# EAGLE board TurtleBoard (EAGLE 7.7.0), part 1 of 2
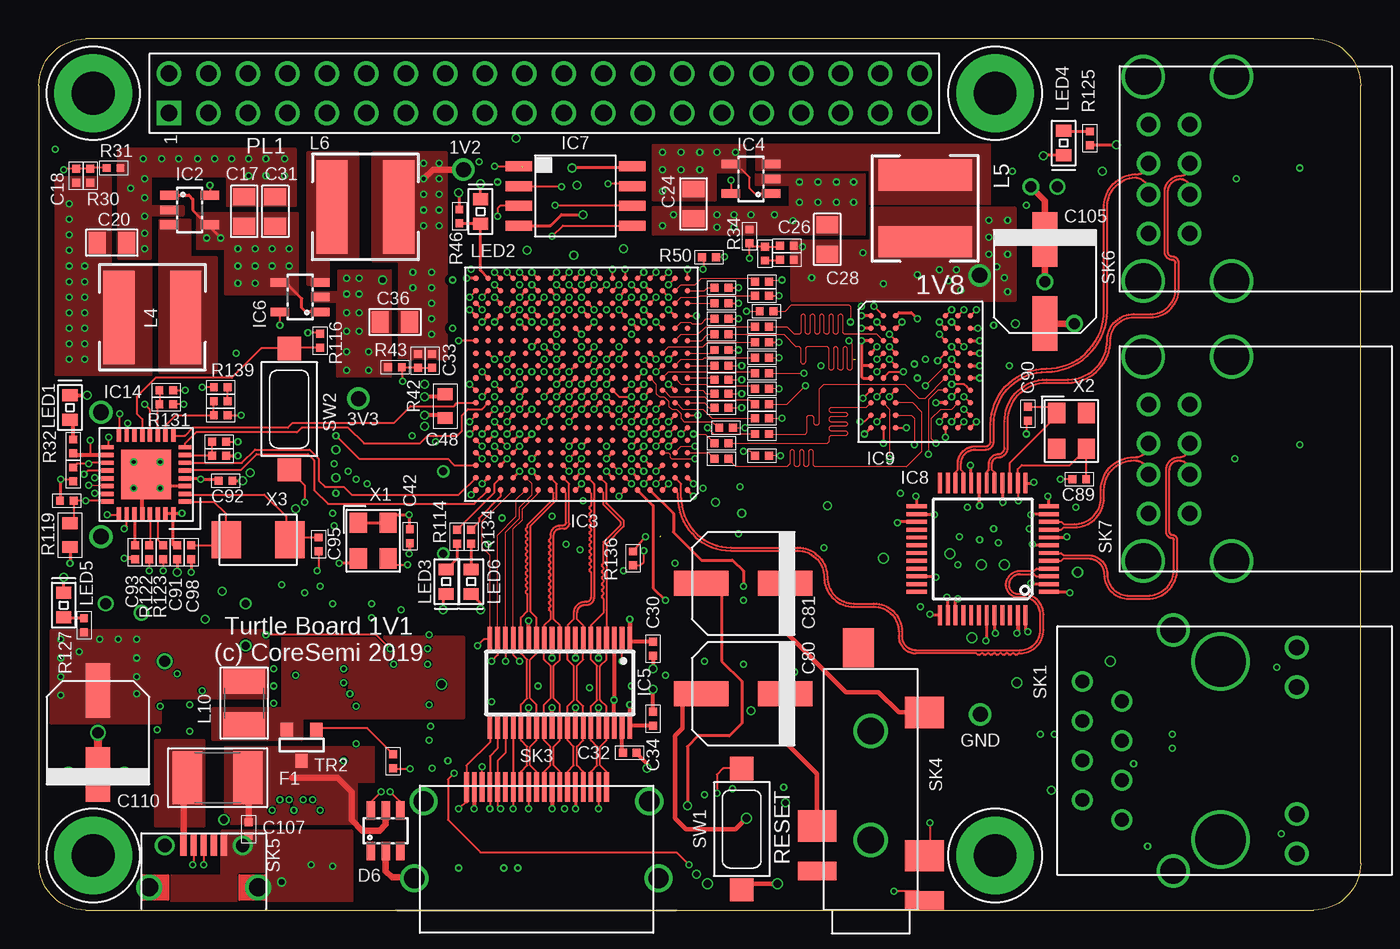
[diagram p7: board, top side]
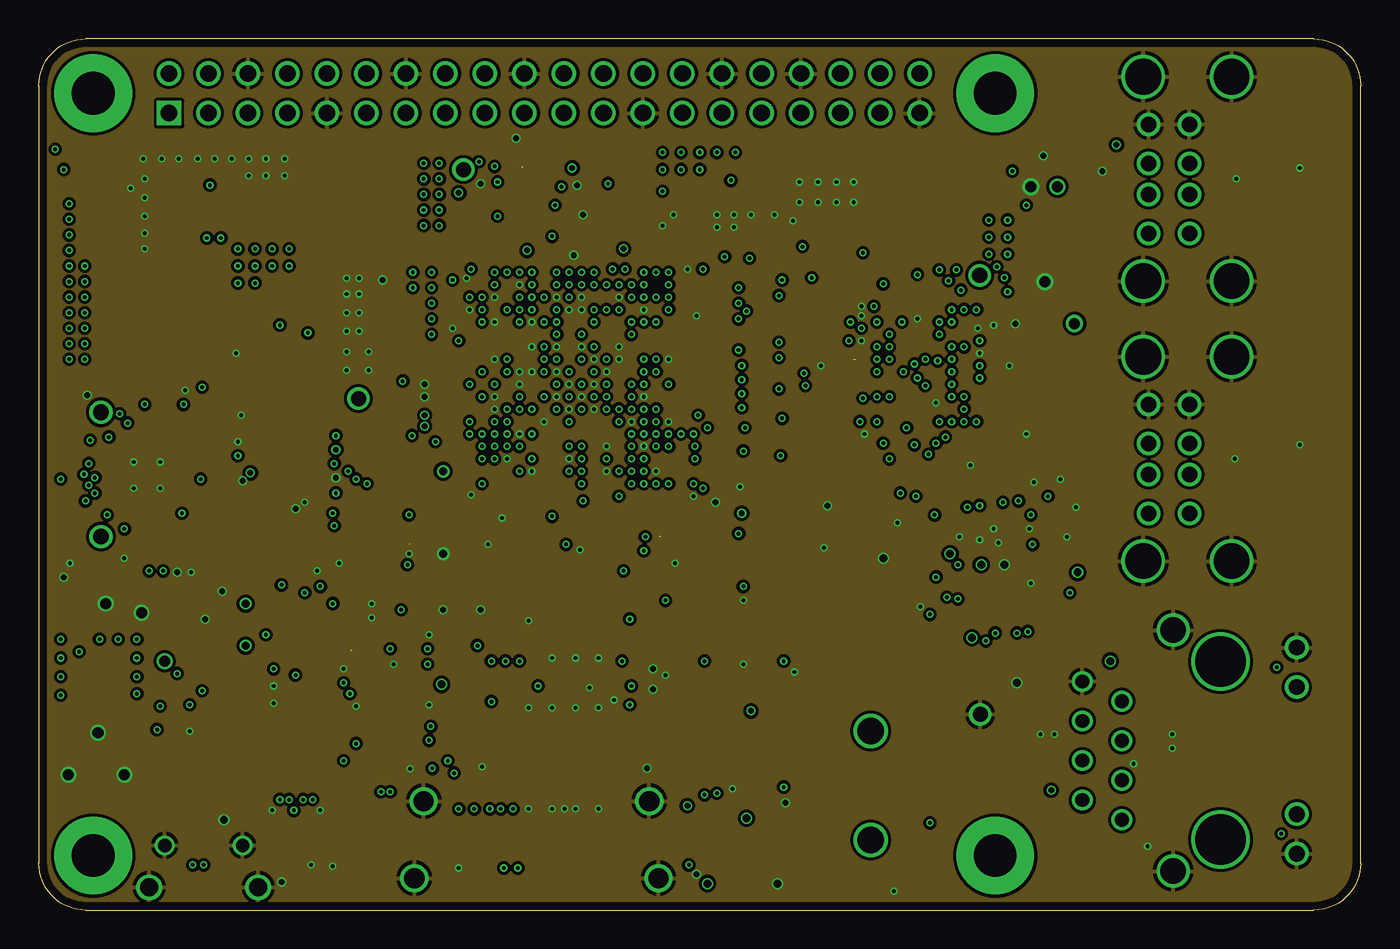
[diagram p8: board, inner layer GND1]
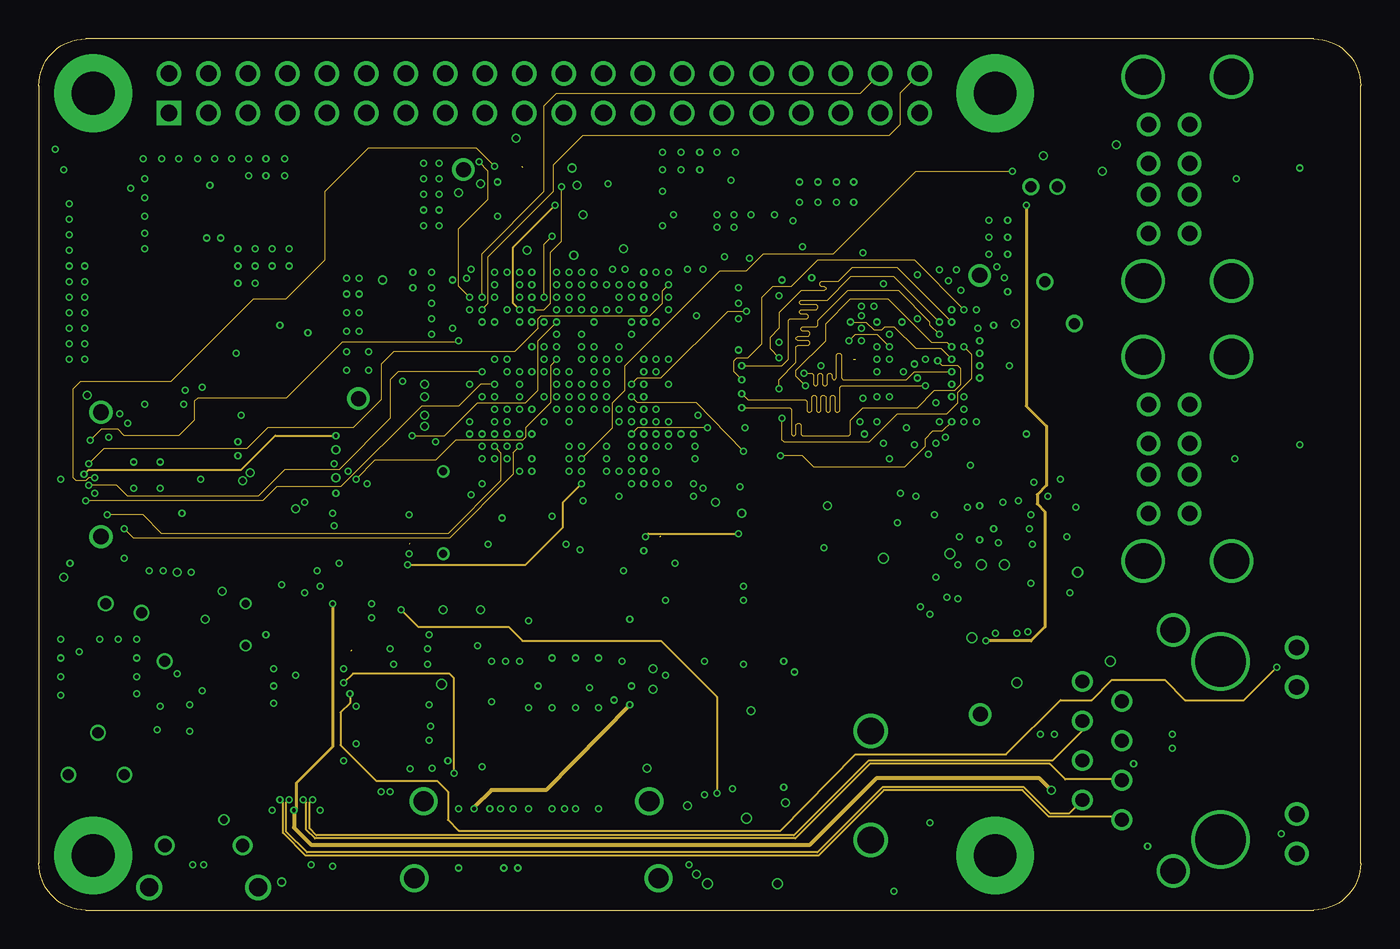
[diagram p9: board, inner layer Sig1]
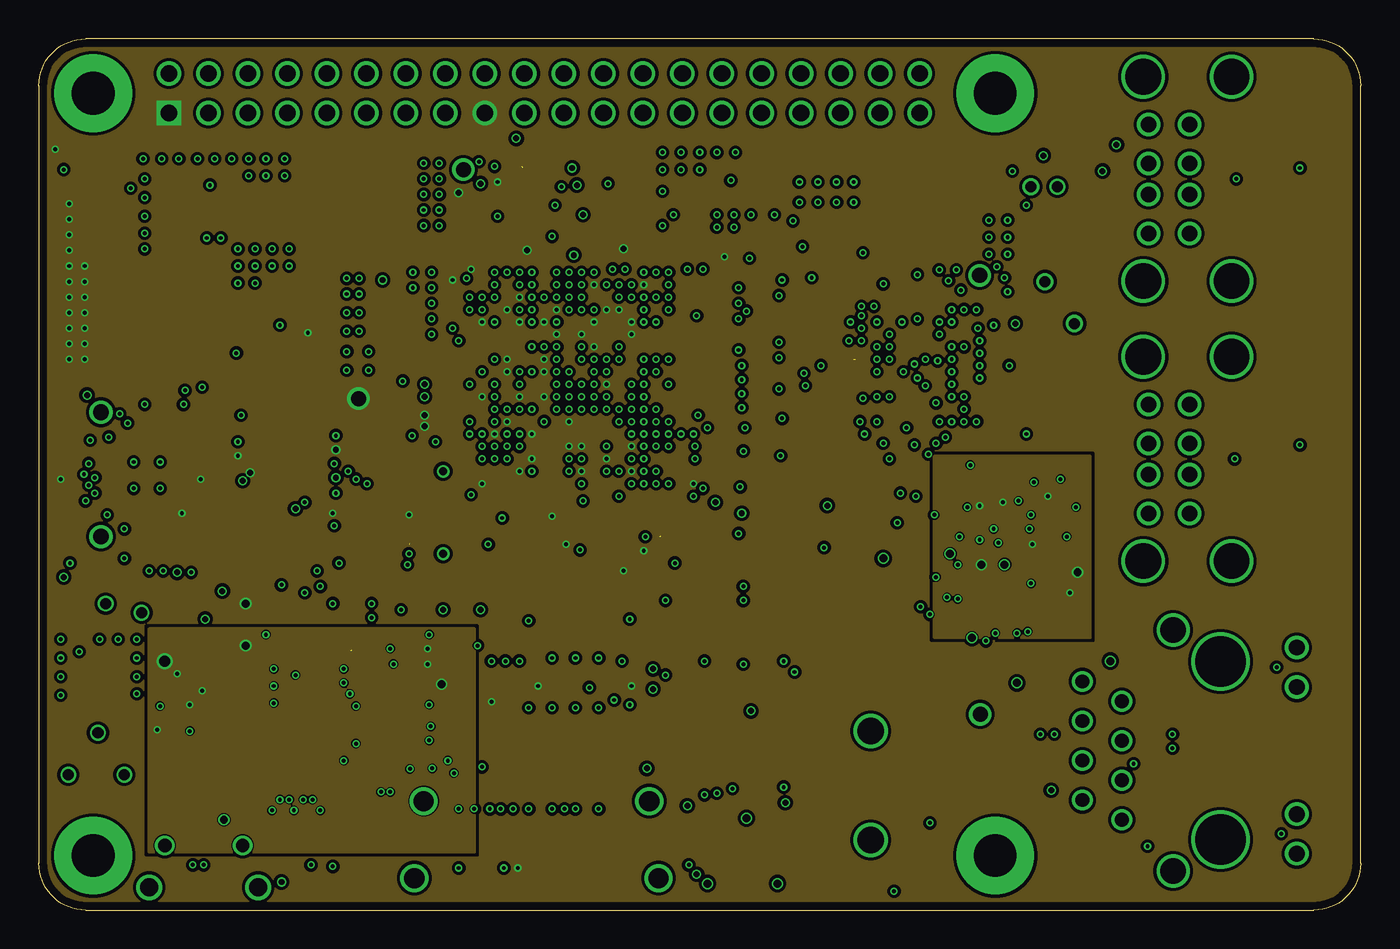
[diagram p10: board, inner layer PWR1]
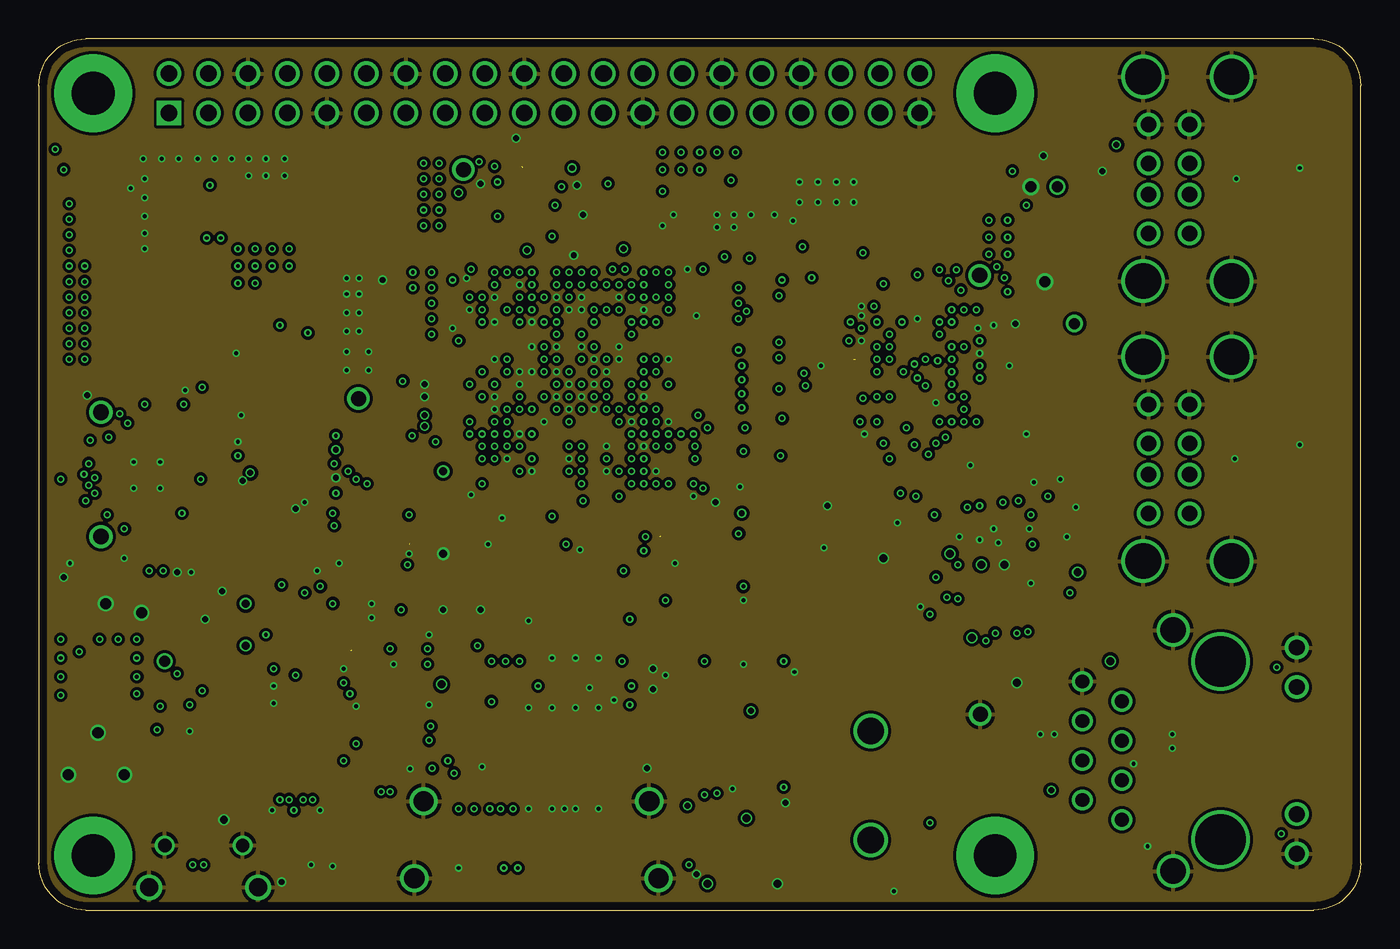
[diagram p11: board, inner layer GND2]
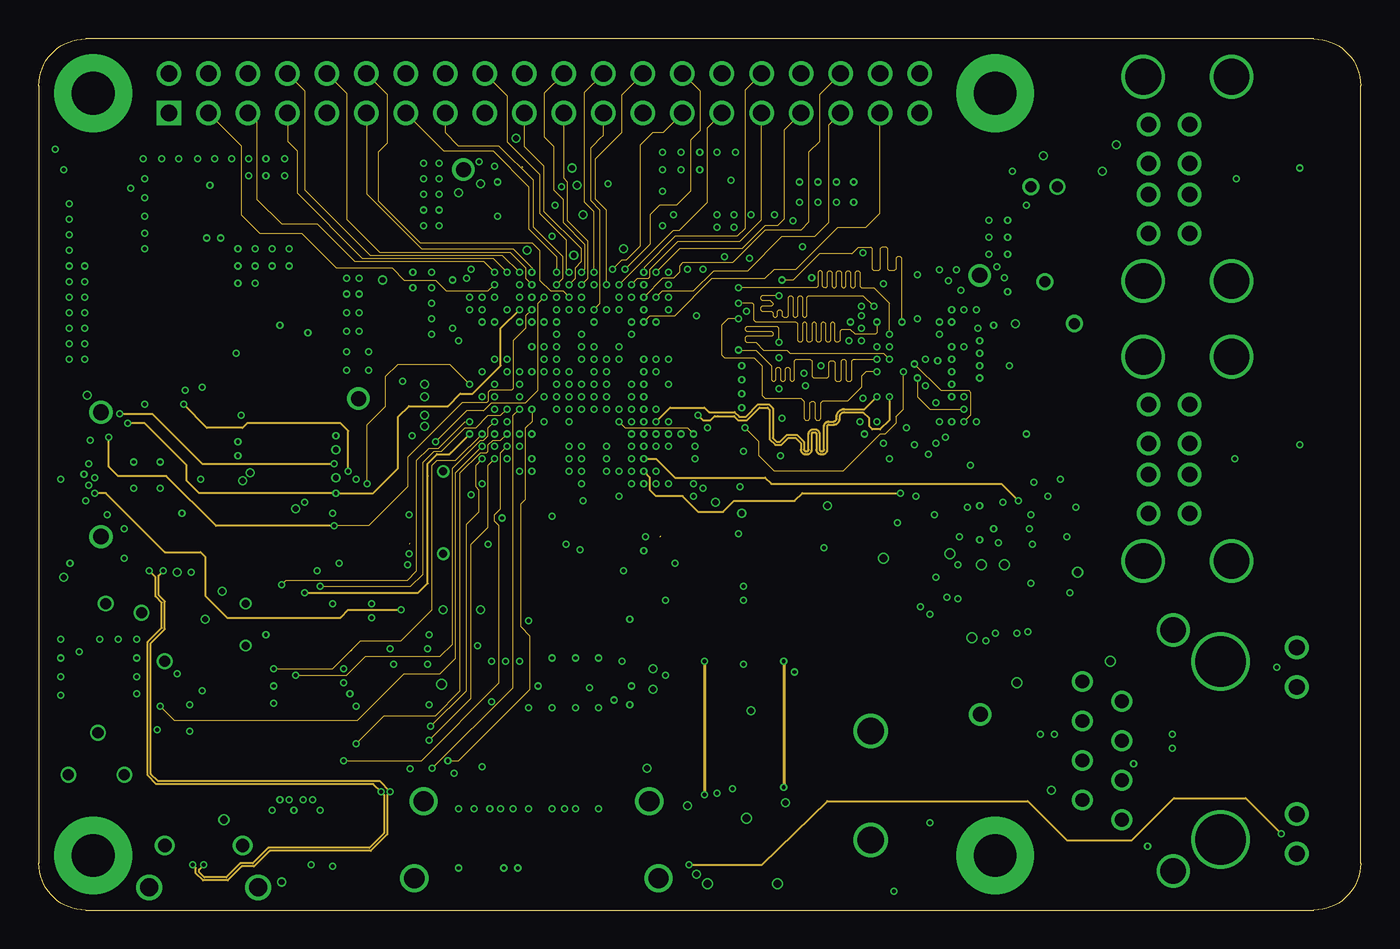
[diagram p12: board, inner layer Sig2]
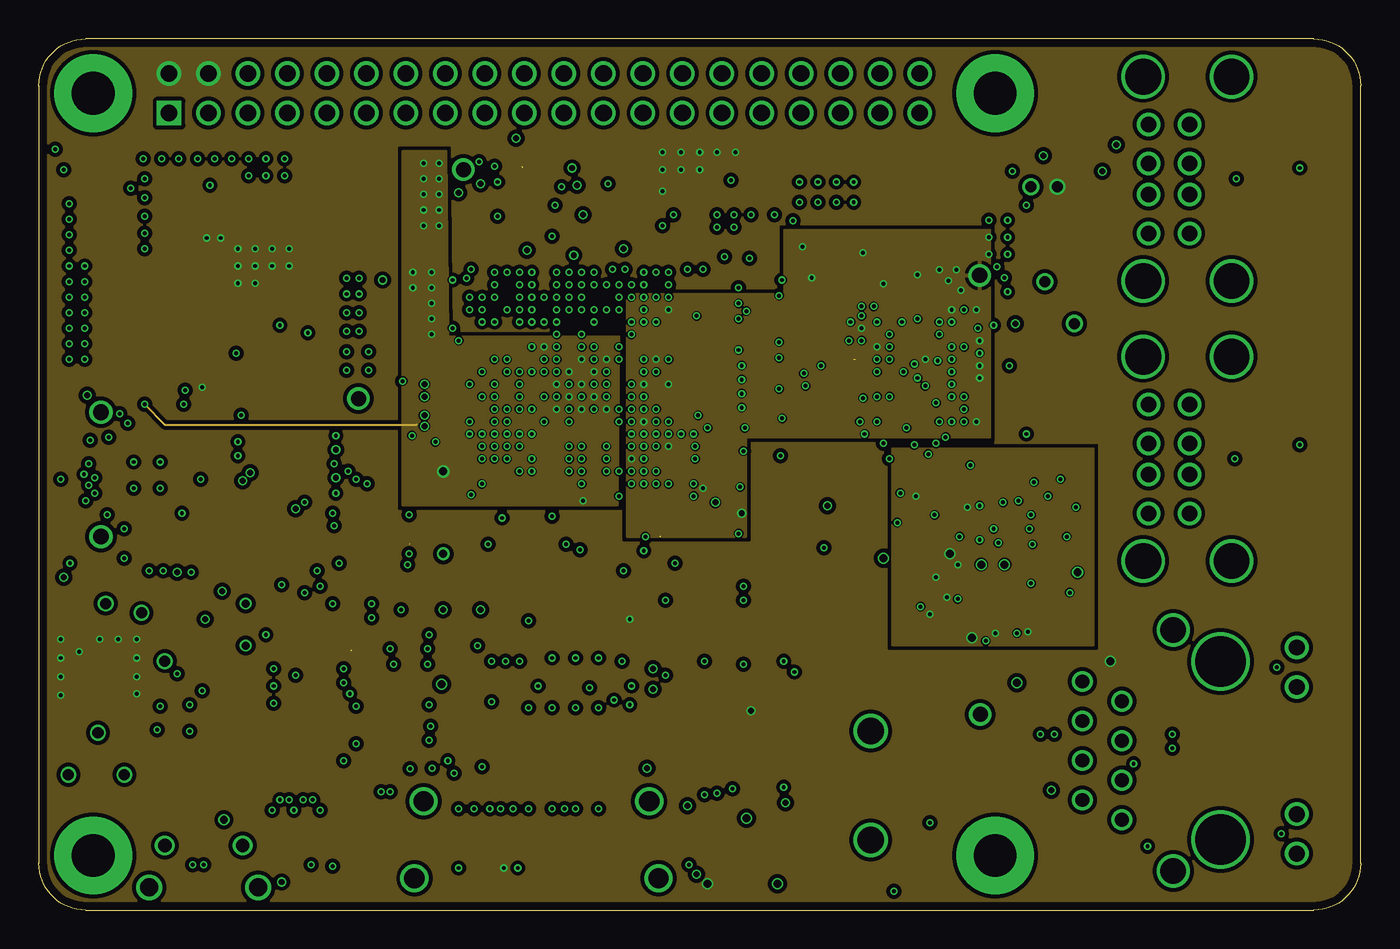
[diagram p13: board, inner layer PWR2]
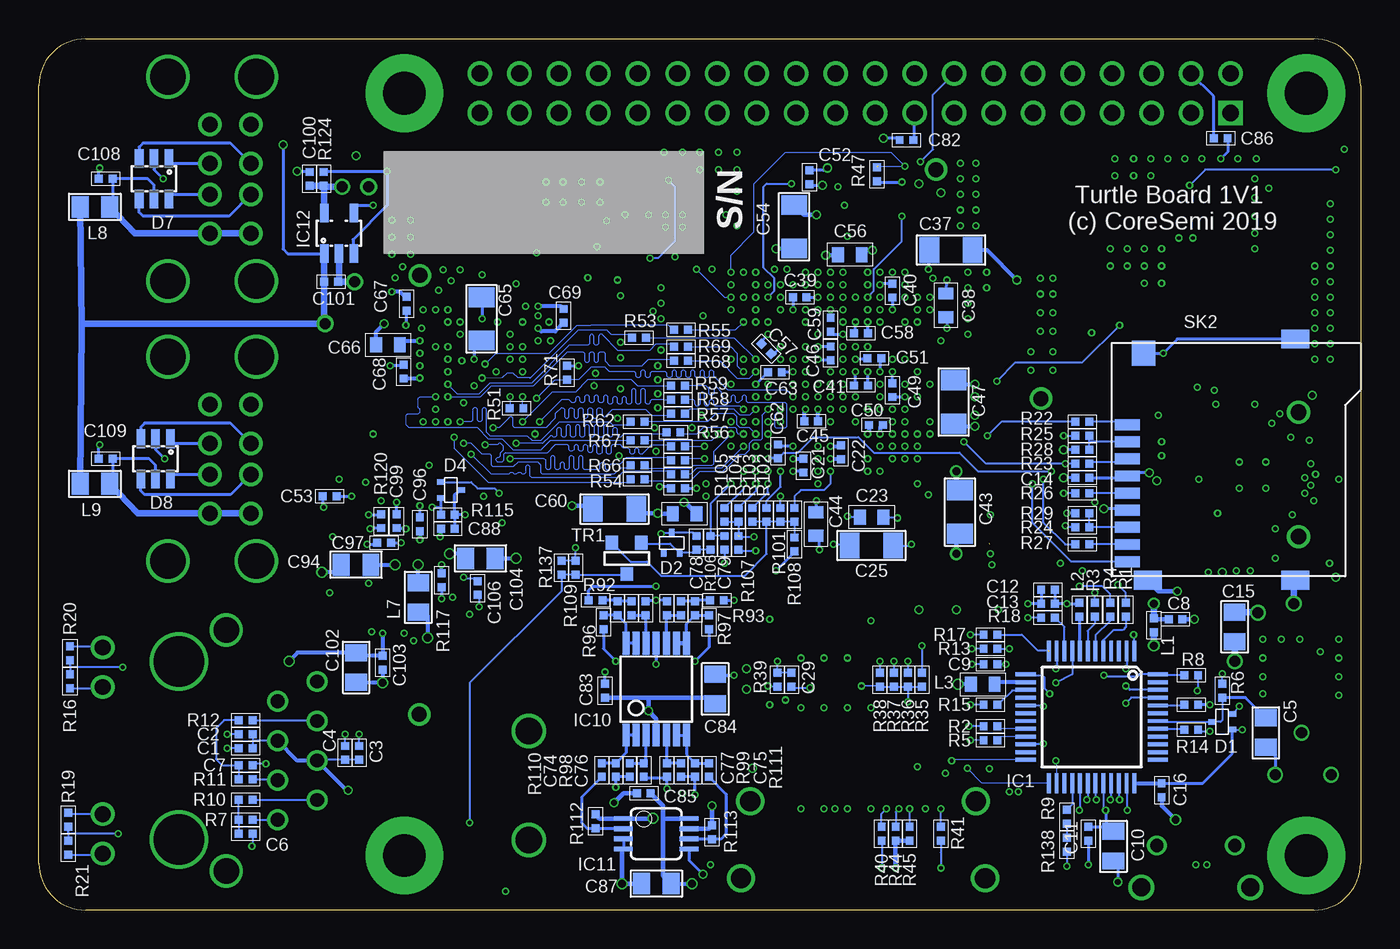
[diagram p14: board, bottom side, seen from below]

Size 85 x 56 mm. Coordinates in mm from the lower left corner, seen from the top.
Outline: 85,3 85,53 arc90 82,56 3,56 arc90 0,53 0,3 arc90 3,0 82,0 arc90 85,3
Copper layers (1*3+5*7+9*11+13*16): Top 0.01778125mm / dielectric 3mil / GND1 0.035559375mm / dielectric 8mil / Sig1 0.035559375mm / dielectric 8mil / PWR1 0.01778125mm / dielectric 14mil / GND2 0.01778125mm / dielectric 8mil / Sig2 0.035559375mm / dielectric 8mil / PWR2 0.035559375mm / dielectric 3mil / Bottom 0.5mil
Design rules "BGA *": minimum track width 3mil, minimum drill 10mil, track to track 3mil, track to pad 3mil, pad to pad 3mil, via to via 3mil, smd to smd 0mil, copper to edge 0.5mm, drill to drill 8mil, minimum pad ring 6mil, minimum via ring 0.101mm, stop-mask expansion 4mil, vias tented up to drill 1000mil, thermal gap 9mil

## Footprints (pad centres in the part's own frame; a part is rotated, then mirrored left to right if it is on the bottom)
0402 = smd 0.508 x 0.508: 1 -0.445,0; 2 0.445,0
0805 = smd 1.092 x 1.397: 1 -0.95,0; 2 0.95,0
0603 = smd 0.762 x 0.965: 1 -0.762,0; 2 0.762,0
1206 = smd 1.27 x 1.651: 1 -1.397,0; 2 1.397,0
CP-6.3DIA = smd 1.6 x 3.5: + 0,2.7; - 0,-2.7
SC-75 = smd 0.356 x 0.508: 1 -0.5,-0.647; 2 0.5,-0.647; 3 0,0.647
SOT23-6L = smd 0.55 x 1.2: 1 -0.95,-1.3; 2 0,-1.3; 3 0.95,-1.3; 4 0.95,1.3; 5 0,1.3; 6 -0.95,1.3
C1812 = smd 1.9 x 3.4: 1 -1.95,0; 2 1.95,0
SCREW-M2.5 = drill 2.75 pad 5: P$1 0,0
LQFP48 = smd 1.3 x 0.25: 1 -4.25,2.75; 2 -4.25,2.25; 3 -4.25,1.75; 4 -4.25,1.25; 5 -4.25,0.75; 6 -4.25,0.25; 7 -4.25,-0.25; 8 -4.25,-0.75; 9 -4.25,-1.25; 10 -4.25,-1.75; 11 -4.25,-2.25; 12 -4.25,-2.75; 25 4.25,-2.75; 26 4.25,-2.25; 27 4.25,-1.75; 28 4.25,-1.25; 29 4.25,-0.75; 30 4.25,-0.25; 31 4.25,0.25; 32 4.25,0.75; 33 4.25,1.25; 34 4.25,1.75; 35 4.25,2.25; 36 4.25,2.75 | smd 0.25 x 1.3: 13 -2.75,-4.25; 14 -2.25,-4.25; 15 -1.75,-4.25; 16 -1.25,-4.25; 17 -0.75,-4.25; 18 -0.25,-4.25; 19 0.25,-4.25; 20 0.75,-4.25; 21 1.25,-4.25; 22 1.75,-4.25; 23 2.25,-4.25; 24 2.75,-4.25; 37 2.75,4.25; 38 2.25,4.25; 39 1.75,4.25; 40 1.25,4.25; 41 0.75,4.25; 42 0.25,4.25; 43 -0.25,4.25; 44 -0.75,4.25; 45 -1.25,4.25; 46 -1.75,4.25; 47 -2.25,4.25; 48 -2.75,4.25
TSOT23-5 = smd 1.2 x 0.55: 1 -1.3,0.95; 2 -1.3,0; 3 -1.3,-0.95; 4 1.3,-0.95; 5 1.3,0.95
CSG324 = smd 0.37 x 0.37: A1 -6.8,6.8; A2 -6,6.8; A3 -5.2,6.8; A4 -4.4,6.8; A5 -3.6,6.8; A6 -2.8,6.8; A7 -2,6.8; A8 -1.2,6.8; A9 -0.4,6.8; A10 0.4,6.8; A11 1.2,6.8; A12 2,6.8; A13 2.8,6.8; A14 3.6,6.8; A15 4.4,6.8; A16 5.2,6.8; A17 6,6.8; A18 6.8,6.8; B1 -6.8,6; B2 -6,6; B3 -5.2,6; B4 -4.4,6; B5 -3.6,6; B6 -2.8,6; B7 -2,6; B8 -1.2,6; B9 -0.4,6; B10 0.4,6; B11 1.2,6; B12 2,6; B13 2.8,6; B14 3.6,6; B15 4.4,6; B16 5.2,6; B17 6,6; B18 6.8,6; C1 -6.8,5.2; C2 -6,5.2; C3 -5.2,5.2; C4 -4.4,5.2; C5 -3.6,5.2; C6 -2.8,5.2; C7 -2,5.2; C8 -1.2,5.2; C9 -0.4,5.2; C10 0.4,5.2; C11 1.2,5.2; C12 2,5.2; C13 2.8,5.2; C14 3.6,5.2; C15 4.4,5.2; C16 5.2,5.2; C17 6,5.2; C18 6.8,5.2; D1 -6.8,4.4; D2 -6,4.4; D3 -5.2,4.4; D4 -4.4,4.4; D5 -3.6,4.4; D6 -2.8,4.4; D7 -2,4.4; D8 -1.2,4.4; D9 -0.4,4.4; D10 0.4,4.4; D11 1.2,4.4; D12 2,4.4; D13 2.8,4.4; D14 3.6,4.4; D15 4.4,4.4; D16 5.2,4.4; D17 6,4.4; D18 6.8,4.4; E1 -6.8,3.6; E2 -6,3.6; E3 -5.2,3.6; E4 -4.4,3.6; E5 -3.6,3.6; E6 -2.8,3.6; E7 -2,3.6; E8 -1.2,3.6; E9 -0.4,3.6; E10 0.4,3.6; E11 1.2,3.6; E12 2,3.6; E13 2.8,3.6; E14 3.6,3.6; E15 4.4,3.6; E16 5.2,3.6; E17 6,3.6; E18 6.8,3.6; F1 -6.8,2.8; F2 -6,2.8; F3 -5.2,2.8; F4 -4.4,2.8; F5 -3.6,2.8; F6 -2.8,2.8; F7 -2,2.8; F8 -1.2,2.8; F9 -0.4,2.8; F10 0.4,2.8; F11 1.2,2.8; F12 2,2.8; F13 2.8,2.8; F14 3.6,2.8; F15 4.4,2.8; F16 5.2,2.8; F17 6,2.8; F18 6.8,2.8; G1 -6.8,2; G2 -6,2; G3 -5.2,2; G4 -4.4,2; G5 -3.6,2; G6 -2.8,2; G7 -2,2; G8 -1.2,2; G9 -0.4,2; G10 0.4,2; G11 1.2,2; G12 2,2; G13 2.8,2; G14 3.6,2; G15 4.4,2; G16 5.2,2; G17 6,2; G18 6.8,2; H1 -6.8,1.2; H2 -6,1.2; H3 -5.2,1.2; H4 -4.4,1.2; H5 -3.6,1.2; H6 -2.8,1.2; H7 -2,1.2; H8 -1.2,1.2; H9 -0.4,1.2; H10 0.4,1.2; H11 1.2,1.2; H12 2,1.2; H13 2.8,1.2; H14 3.6,1.2; H15 4.4,1.2; H16 5.2,1.2; H17 6,1.2; H18 6.8,1.2; J1 -6.8,0.4; J2 -6,0.4; J3 -5.2,0.4; J4 -4.4,0.4; J5 -3.6,0.4; J6 -2.8,0.4; J7 -2,0.4; J8 -1.2,0.4; J9 -0.4,0.4; J10 0.4,0.4; J11 1.2,0.4; J12 2,0.4; J13 2.8,0.4; J14 3.6,0.4; J15 4.4,0.4; J16 5.2,0.4; J17 6,0.4; J18 6.8,0.4; K1 -6.8,-0.4; K2 -6,-0.4; K3 -5.2,-0.4; K4 -4.4,-0.4; K5 -3.6,-0.4; K6 -2.8,-0.4; K7 -2,-0.4; K8 -1.2,-0.4; K9 -0.4,-0.4; K10 0.4,-0.4; K11 1.2,-0.4; K12 2,-0.4; K13 2.8,-0.4; K14 3.6,-0.4; K15 4.4,-0.4; K16 5.2,-0.4; K17 6,-0.4; K18 6.8,-0.4; L1 -6.8,-1.2; L2 -6,-1.2; L3 -5.2,-1.2; L4 -4.4,-1.2; L5 -3.6,-1.2; L6 -2.8,-1.2; L7 -2,-1.2; L8 -1.2,-1.2; L9 -0.4,-1.2; L10 0.4,-1.2; L11 1.2,-1.2; L12 2,-1.2; L13 2.8,-1.2; L14 3.6,-1.2; L15 4.4,-1.2; L16 5.2,-1.2; L17 6,-1.2; L18 6.8,-1.2; M1 -6.8,-2; M2 -6,-2; M3 -5.2,-2; M4 -4.4,-2; M5 -3.6,-2; M6 -2.8,-2; M7 -2,-2; M8 -1.2,-2; M9 -0.4,-2; M10 0.4,-2; M11 1.2,-2; M12 2,-2; M13 2.8,-2; M14 3.6,-2; M15 4.4,-2; M16 5.2,-2; M17 6,-2; M18 6.8,-2; N1 -6.8,-2.8; N2 -6,-2.8; N3 -5.2,-2.8; N4 -4.4,-2.8; N5 -3.6,-2.8; N6 -2.8,-2.8; N7 -2,-2.8; N8 -1.2,-2.8; N9 -0.4,-2.8; N10 0.4,-2.8; N11 1.2,-2.8; N12 2,-2.8; N13 2.8,-2.8; N14 3.6,-2.8; N15 4.4,-2.8; N16 5.2,-2.8; N17 6,-2.8; N18 6.8,-2.8; P1 -6.8,-3.6; P2 -6,-3.6; P3 -5.2,-3.6; P4 -4.4,-3.6; P5 -3.6,-3.6; P6 -2.8,-3.6; P7 -2,-3.6; P8 -1.2,-3.6; P9 -0.4,-3.6; P10 0.4,-3.6; P11 1.2,-3.6; P12 2,-3.6; P13 2.8,-3.6; P14 3.6,-3.6; P15 4.4,-3.6; P16 5.2,-3.6; P17 6,-3.6; P18 6.8,-3.6; R1 -6.8,-4.4; R2 -6,-4.4; R3 -5.2,-4.4; R4 -4.4,-4.4; R5 -3.6,-4.4; R6 -2.8,-4.4; R7 -2,-4.4; R8 -1.2,-4.4; R9 -0.4,-4.4; R10 0.4,-4.4; R11 1.2,-4.4; R12 2,-4.4; R13 2.8,-4.4; R14 3.6,-4.4; R15 4.4,-4.4; R16 5.2,-4.4; R17 6,-4.4; R18 6.8,-4.4; T1 -6.8,-5.2; T2 -6,-5.2; T3 -5.2,-5.2; T4 -4.4,-5.2; T5 -3.6,-5.2; T6 -2.8,-5.2; T7 -2,-5.2; T8 -1.2,-5.2; T9 -0.4,-5.2; T10 0.4,-5.2; T11 1.2,-5.2; T12 2,-5.2; T13 2.8,-5.2; T14 3.6,-5.2; T15 4.4,-5.2; T16 5.2,-5.2; T17 6,-5.2; T18 6.8,-5.2; U1 -6.8,-6; U2 -6,-6; U3 -5.2,-6; U4 -4.4,-6; U5 -3.6,-6; U6 -2.8,-6; U7 -2,-6; U8 -1.2,-6; U9 -0.4,-6; U10 0.4,-6; U11 1.2,-6; U12 2,-6; U13 2.8,-6; U14 3.6,-6; U15 4.4,-6; U16 5.2,-6; U17 6,-6; U18 6.8,-6; V1 -6.8,-6.8; V2 -6,-6.8; V3 -5.2,-6.8; V4 -4.4,-6.8; V5 -3.6,-6.8; V6 -2.8,-6.8; V7 -2,-6.8; V8 -1.2,-6.8; V9 -0.4,-6.8; V10 0.4,-6.8; V11 1.2,-6.8; V12 2,-6.8; V13 2.8,-6.8; V14 3.6,-6.8; V15 4.4,-6.8; V16 5.2,-6.8; V17 6,-6.8; V18 6.8,-6.8
TSSOP38_NOPAD = smd 1.6 x 0.3: 1 -2.8,4.5; 2 -2.8,4; 3 -2.8,3.5; 4 -2.8,3; 5 -2.8,2.5; 6 -2.8,2; 7 -2.8,1.5; 8 -2.8,1; 9 -2.8,0.5; 10 -2.8,0; 11 -2.8,-0.5; 12 -2.8,-1; 13 -2.8,-1.5; 14 -2.8,-2; 15 -2.8,-2.5; 16 -2.8,-3; 17 -2.8,-3.5; 18 -2.8,-4; 19 -2.8,-4.5; 20 2.8,-4.5; 21 2.8,-4; 22 2.8,-3.5; 23 2.8,-3; 24 2.8,-2.5; 25 2.8,-2; 26 2.8,-1.5; 27 2.8,-1; 28 2.8,-0.5; 29 2.8,0; 30 2.8,0.5; 31 2.8,1; 32 2.8,1.5; 33 2.8,2; 34 2.8,2.5; 35 2.8,3; 36 2.8,3.5; 37 2.8,4; 38 2.8,4.5
SOIJ-8 = smd 1.7 x 0.65: 1 -3.65,1.905; 2 -3.65,0.635; 3 -3.65,-0.635; 4 -3.65,-1.905; 5 3.65,-1.905; 6 3.65,-0.635; 7 3.65,0.635; 8 3.65,1.905
VBGA-60 = smd 0.37 x 0.37: A1 -3.2,3.6; A2 -2.4,3.6; A3 -1.6,3.6; A7 1.6,3.6; A8 2.4,3.6; A9 3.2,3.6; B1 -3.2,2.8; B2 -2.4,2.8; B3 -1.6,2.8; B7 1.6,2.8; B8 2.4,2.8; B9 3.2,2.8; C1 -3.2,2; C2 -2.4,2; C3 -1.6,2; C7 1.6,2; C8 2.4,2; C9 3.2,2; D1 -3.2,1.2; D2 -2.4,1.2; D3 -1.6,1.2; D7 1.6,1.2; D8 2.4,1.2; D9 3.2,1.2; E1 -3.2,0.4; E2 -2.4,0.4; E3 -1.6,0.4; E7 1.6,0.4; E8 2.4,0.4; E9 3.2,0.4; F1 -3.2,-0.4; F2 -2.4,-0.4; F3 -1.6,-0.4; F7 1.6,-0.4; F8 2.4,-0.4; F9 3.2,-0.4; G1 -3.2,-1.2; G2 -2.4,-1.2; G3 -1.6,-1.2; G7 1.6,-1.2; G8 2.4,-1.2; G9 3.2,-1.2; H1 -3.2,-2; H2 -2.4,-2; H3 -1.6,-2; H7 1.6,-2; H8 2.4,-2; H9 3.2,-2; J1 -3.2,-2.8; J2 -2.4,-2.8; J3 -1.6,-2.8; J7 1.6,-2.8; J8 2.4,-2.8; J9 3.2,-2.8; K1 -3.2,-3.6; K2 -2.4,-3.6; K3 -1.6,-3.6; K7 1.6,-3.6; K8 2.4,-3.6; K9 3.2,-3.6
TSSOP14 = smd 0.45 x 1.45: 1 -1.95,-2.95; 2 -1.3,-2.95; 3 -0.65,-2.95; 4 0,-2.95; 5 0.65,-2.95; 6 1.3,-2.95; 7 1.95,-2.95; 8 1.95,2.95; 9 1.3,2.95; 10 0.65,2.95; 11 0,2.95; 12 -0.65,2.95; 13 -1.3,2.95; 14 -1.95,2.95
MSOP08 = smd 0.3 x 1.2: 1 -0.976,-2.113; 2 -0.326,-2.113; 3 0.324,-2.113; 4 0.974,-2.113; 5 0.974,2.112; 6 0.324,2.112; 7 -0.326,2.112; 8 -0.976,2.112
SOT23-5 = smd 0.55 x 1.2: 1 -0.95,-1.3; 2 0,-1.3; 3 0.95,-1.3; 4 0.95,1.3; 5 -0.95,1.3
QFN-32 = smd 0.28 x 0.8: 1 -1.75,-2.5; 2 -1.25,-2.5; 3 -0.75,-2.5; 4 -0.25,-2.5; 5 0.25,-2.5; 6 0.75,-2.5; 7 1.25,-2.5; 8 1.75,-2.5; 17 1.75,2.5; 18 1.25,2.5; 19 0.75,2.5; 20 0.25,2.5; 21 -0.25,2.5; 22 -0.75,2.5; 23 -1.25,2.5; 24 -1.75,2.5 | smd 0.8 x 0.28: 9 2.5,-1.75; 10 2.5,-1.25; 11 2.5,-0.75; 12 2.5,-0.25; 13 2.5,0.25; 14 2.5,0.75; 15 2.5,1.25; 16 2.5,1.75; 25 -2.5,1.75; 26 -2.5,1.25; 27 -2.5,0.75; 28 -2.5,0.25; 29 -2.5,-0.25; 30 -2.5,-0.75; 31 -2.5,-1.25; 32 -2.5,-1.75 | smd 3.2 x 3.2: P 0,0
SRN6045 = smd 2 x 6: 1 -2.15,0; 2 2.15,0
C0805 = smd 1.092 x 1.397: 1 -0.95,0; 2 0.95,0
C1210 = smd 1.6 x 2.7: 1 -1.4,0; 2 1.4,0
0603-LED = smd 0.762 x 0.965: A -0.787,0; C 0.787,0
2X20_0.1"-HEADER = drill 1.067 square: 1 -1.27,24.13 | drill 1.067: 2 1.27,24.13; 3 -1.27,21.59; 4 1.27,21.59; 5 -1.27,19.05; 6 1.27,19.05; 7 -1.27,16.51; 8 1.27,16.51; 9 -1.27,13.97; 10 1.27,13.97; 11 -1.27,11.43; 12 1.27,11.43; 13 -1.27,8.89; 14 1.27,8.89; 15 -1.27,6.35; 16 1.27,6.35; 17 -1.27,3.81; 18 1.27,3.81; 19 -1.27,1.27; 20 1.27,1.27; 21 -1.27,-1.27; 22 1.27,-1.27; 23 -1.27,-3.81; 24 1.27,-3.81; 25 -1.27,-6.35; 26 1.27,-6.35; 27 -1.27,-8.89; 28 1.27,-8.89; 29 -1.27,-11.43; 30 1.27,-11.43; 31 -1.27,-13.97; 32 1.27,-13.97; 33 -1.27,-16.51; 34 1.27,-16.51; 35 -1.27,-19.05; 36 1.27,-19.05; 37 -1.27,-21.59; 38 1.27,-21.59; 39 -1.27,-24.13; 40 1.27,-24.13
RJ45-HR911105A = drill 0.89: 1 4.45,-6.35; 2 3.18,-8.89; 3 1.91,-6.35; 4 0.64,-8.89; 5 -0.63,-6.35; 6 -1.9,-8.89; 7 -3.17,-6.35; 8 -4.44,-8.89 | drill 1.02: 9 6.625,4.9; 10 4.085,4.9; 11 -4.085,4.9; 12 -6.625,4.9 | drill 1.63: 13 7.745,-3.05; 14 -7.745,-3.05 | drill 3.25: 15 5.715,0; 16 -5.715,0
SD-MICRO-ALIEXPRESS = smd 0.7 x 1.6: 1 3.2,15; 2 2.1,15; 3 1,15; 4 -0.1,15; 5 -1.2,15; 6 -2.3,15; 7 -3.4,15; 8 -4.5,15; 9 -5.6,15 | smd 1.2 x 1.8: P$1 -6.8,13.7; P$2 -6.8,4.2; P$3 8.7,4.2 | smd 1.6 x 1.5: P$4 7.8,13.95 | drill 1 pad 1.016: P$5 -4,4; P$6 4,4
HDMI = smd 0.3 x 1.9: 1 4.5,0.9; 2 4,0.9; 3 3.5,0.9; 4 3,0.9; 5 2.5,0.9; 6 2,0.9; 7 1.5,0.9; 8 1,0.9; 9 0.5,0.9; 10 0,0.9; 11 -0.5,0.9; 12 -1,0.9; 13 -1.5,0.9; 14 -2,0.9; 15 -2.5,0.9; 16 -3,0.9; 17 -3.5,0.9; 18 -4,0.9; 19 -4.5,0.9 | drill 1.3: 20 7.25,0; 21 -7.25,0; 22 -7.85,-4.95; 23 7.85,-4.95
3.5MM-PJ-328B = smd 2 x 2.5: 3 3.5,-3.45; 4 5.4,3.45; 6 12.7,-3.45 | smd 2.5 x 2: 5 16.85,0.8 | smd 1.2 x 2.5: 7 2.5,3.45; 8 0.6,-3.45 | drill 1.7 pad 1.7: P$1 4.5,0; P$2 11.5,0
USB-MICRO-B-PTH = smd 0.4 x 1.35: 1 -1.3,4.15; 2 -0.65,4.15; 3 0,4.15; 4 0.65,4.15; 5 1.3,4.15 | drill 0.85 pad 1.25: P$1 -2.5,4.15; P$2 2.5,4.15 | drill 1.15 pad 1.55: P$3 -3.5,1.45; P$4 3.5,1.45
USB-A-DUAL = drill 1: 1 -3.5,5.33; 2 -1,5.33; 3 1,5.33; 4 3.5,5.33; 5 -3.5,2.71; 6 -1,2.71; 7 1,2.71; 8 3.5,2.71 | drill 2.3: 9 -6.57,5.68; 10 6.57,5.68; 11 -6.57,0; 12 6.57,0
TACT-6X3 = smd 1.5 x 1.5: P$1 -3.9,0; P$2 3.9,0
P1-10 = drill 0.965: 1 0,0
SOT23 = smd 0.8 x 0.9: 1 -0.95,-1; 2 0.95,-1; 3 0,1
XTAL-SMD-32X25 = smd 1.3 x 1.1: 1 -1.15,-0.95; 2 1.15,-0.95; 3 1.15,0.95; 4 -1.15,0.95
CRYSTAL-ABM3 = smd 1.9 x 2.4: 1 -2.05,0; 2 2.05,0

## Placement (x,y rotation side)
C1  10nF  [0402]  71.7,10.4 0 bottom
C2  100nF  [0402]  71.7,11.3 0 bottom
C3  10nF  [0402]  64.4,10.1 270 bottom
C4  100nF  [0402]  65.3,10.1 270 bottom
C5  10uF  [0805]  6.1,11.4 90 bottom
C6  390pF  [0402]  71.7,4.9 180 bottom
C7  390pF  [0402]  71.7,9.3 180 bottom
C8  100nF  [0402]  11.9,18.7 180 bottom
C9  100nF  [0402]  23.8,15.8 180 bottom
C10  22uF  [0805]  15.9,4.1 90 bottom
C11  100nF  [0402]  17.5,4.9 90 bottom
C12  10nF  [0402]  20.1,20.6 0 bottom
C13  100nF  [0402]  20.1,19.7 0 bottom
C14  100nF  [0402]  17.9,27.8 0 bottom
C15  10uF  [0805]  8.1,18.2 270 bottom
C16  100nF  [0402]  12.8,7.7 90 bottom
C17  10uF  [0805]  13.2,44.9 270 top
C18  DNP  [0402]  2.4,47.2 90 top
C20  22uF  [0805]  4.7,42.9 180 top
C21  470nF  [0402]  35.82,28.57 270 bottom
C22  470nF  [0402]  33.42,29.42 270 bottom
C23  4u7F  [0603]  31.45,25.26 0 bottom
C24  10uF  [0805]  42.1,45.4 90 top
C25  100uF  [1206]  31.46,23.43 0 bottom
C26  DNP  [0402]  48.1,42.7 180 top
C28  22uF  [0805]  50.7,43.1 270 top
C29  100nF  [0402]  36.6,14.8 90 bottom
C30  100nF  [0402]  39.5,16.8 90 top
C31  10uF  [0805]  15.2,44.9 270 top
C32  100nF  [0402]  38,10.1 180 top
C33  DNP  [0402]  25.3,35.3 270 top
C34  100nF  [0402]  39.5,12.3 270 top
C36  22uF  [0805]  22.9,37.8 0 top
C37  100uF  [1206]  26.34,42.43 0 bottom
C38  4u7F  [0603]  26.67,38.87 270 bottom
C39  470nF  [0402]  36.07,39.38 0 bottom
C40  470nF  [0402]  30.12,39.82 90 bottom
C41  470nF  [0402]  32.13,33.72 0 bottom
C42  100nF  [0402]  23.86,24.03 90 top
C43  100uF  [1206]  25.77,25.58 270 bottom
C44  4u7F  [0603]  35.03,24.81 270 bottom
C45  470nF  [0402]  35.33,31.42 180 bottom
C46  470nF  [0402]  34.08,35.78 90 bottom
C47  100uF  [1206]  26.17,32.66 90 bottom
C48  4u7F  [0603]  26.13,32.39 90 top
C49  470nF  [0402]  30.12,33.42 270 bottom
C50  470nF  [0402]  31.17,31.18 0 bottom
C51  470nF  [0402]  31.27,35.48 0 bottom
C52  100nF  [0402]  35.45,47.11 90 bottom
C53  100nF  [0402]  66.3,26.6 0 bottom
C54  100uF  [1206]  36.43,43.92 90 bottom
C56  4u7F  [0603]  32.85,42.13 180 bottom
C57  470nF  [0402]  38.22,36.08 315 bottom
C58  470nF  [0402]  32.13,37.08 0 bottom
C59  470nF  [0402]  34.08,37.62 90 bottom
C60  100uF  [1206]  47.98,25.77 180 bottom
C61  4u7F  [0603]  43.47,25.47 0 bottom
C62  470nF  [0402]  37.48,29.48 90 bottom
C63  470nF  [0402]  37.67,34.58 0 bottom
C64  470nF  [0402]  43.9,27.1 180 bottom
C65  100uF  [1206]  56.53,38 90 bottom
C66  4u7F  [0603]  62.55,36.33 180 bottom
C67  220nF  [0402]  61.35,38.97 270 bottom
C68  220nF  [0402]  61.55,34.61 90 bottom
C69  220nF  [0402]  51.25,38.19 90 bottom
C70  3n9F  [0402]  47.8,19.4 270 bottom
C71  3n9F  [0402]  42.8,19.4 270 bottom
C72  3n9F  [0402]  46,19.4 270 bottom
C73  3n9F  [0402]  44.6,19.4 270 bottom
C74  10nF  [0402]  47.9,9 90 bottom
C75  10nF  [0402]  42.8,9 90 bottom
C76  1n5F  [0402]  46.1,9 90 bottom
C77  1n5F  [0402]  44.6,9 90 bottom
C78  DNP  [0402]  42.7,23.6 270 bottom
C79  DNP  [0402]  40.9,23.6 270 bottom
C80  220uF  [CP-6.3DIA]  45.3,13.9 90 top
C81  220uF  [CP-6.3DIA]  45.3,21 90 top
C82  100nF  [0402]  29.2,49.5 180 bottom
C83  100nF  [0402]  48.6,14.1 270 bottom
C84  10uF  [0805]  41.5,14.2 270 bottom
C85  100nF  [0402]  46.1,7.5 0 bottom
C86  100nF  [0402]  9,49.6 0 bottom
C87  10uF  [0805]  45.3,1.7 0 bottom
C88  1uF  [0402]  58.7,24.5 0 bottom
C89  18pF  [0402]  66.9,27.7 0 top
C90  18pF  [0402]  63.6,31.9 90 top
C91  100nF  [0402]  8.9,23 90 top
C92  100nF  [0402]  12,27.6 180 top
C93  1uF  [0402]  6.2,23 90 top
C94  10uF  [0805]  64.6,22.2 180 bottom
C95  18pF  [0402]  18,23.5 90 top
C96  100nF  [0402]  60.5,24.8 90 bottom
C97  100nF  [0402]  62.8,23.6 180 bottom
C98  18pF  [0402]  9.8,23 90 top
C99  100nF  [0402]  62,25 90 bottom
C100  1uF  [0402]  67.6,47 270 bottom
C101  100nF  [0402]  66.2,40.4 180 bottom
C102  10uF  [0805]  64.6,15.6 90 bottom
C103  100nF  [0402]  62.9,15.9 90 bottom
C104  10uF  [0805]  56.6,22.6 180 bottom
C105  220uF  [CP-6.3DIA]  64.7,40.4 180 top
C106  100nF  [0402]  56.8,20.7 90 bottom
C107  1uF  [0402]  13.5,5.2 270 top
C108  100nF  [0402]  80.7,47 0 bottom
C109  100nF  [0402]  80.7,29 0 bottom
C110  220uF  [CP-6.3DIA]  3.8,11.4 0 top
D1  BAW56  [SC-75]  8.9,12.1 90 bottom
D2  BAW56  [SC-75]  44.3,23.6 0 bottom
D4  BAW56  [SC-75]  58.5,27 270 bottom
D6  SRV05-4  [SOT23-6L]  22.3,5.1 0 top
D7  SRV05-4  [SOT23-6L]  77.6,47 180 bottom
D8  SRV05-4  [SOT23-6L]  77.5,29 180 bottom
F1  3A  [C1812]  11.5,8.5 180 top
H1  MOUNTING-SCREW-M2.5  [SCREW-M2.5]  3.5,3.5 0 top
H2  MOUNTING-SCREW-M2.5  [SCREW-M2.5]  61.5,3.5 0 top
H3  MOUNTING-SCREW-M2.5  [SCREW-M2.5]  3.5,52.5 0 top
H4  MOUNTING-SCREW-M2.5  [SCREW-M2.5]  61.5,52.5 0 top
IC1  IP101A  [LQFP48]  17.3,12.4 270 bottom
IC2  PAM2312A  [TSOT23-5]  9.7,45 0 top
IC3  XC6SLX45-2CSG324C  [CSG324]  34.9,33.8 180 top
IC4  PAM2312A  [TSOT23-5]  45.8,47 180 top
IC5  TPD12S521  [TSSOP38_NOPAD]  33.5,14.6 270 top
IC6  PAM2312A  [TSOT23-5]  16.8,39.4 180 top
IC7  MX25R3235F  [SOIJ-8]  34.5,45.9 0 top
IC8  GL850G  [LQFP48]  60.7,23.2 180 top
IC9  MT46H64M16  [VBGA-60]  56.7,34.6 0 top
IC10  LMV324  [TSSOP14]  45.3,14.2 0 bottom
IC11  TS482  [MSOP08]  45.3,4.9 270 bottom
IC12  AP22802B  [SOT23-5]  65.7,43.5 0 bottom
IC14  ATMEGA32U2-QFN32  [QFN-32]  6.9,28 90 top
L1  1k 100mA  [0402]  13.3,18.3 270 bottom
L2  1k 100mA  [0402]  18.1,19.3 270 bottom
L3  470R 100mA  [0603]  24.3,14.5 180 bottom
L4  4u7H  [SRN6045]  7.3,38.1 180 top
L5  4u7H  [SRN6045]  57,45.1 270 top
L6  2u2H  [SRN6045]  21,45.2 0 top
L7  600R  [C0805]  60.6,20.1 270 bottom
L8  600R  [C0805]  81.4,45.2 0 bottom
L9  600R  [C0805]  81.4,27.4 0 bottom
L10  600R  [C1210]  13.2,13.3 90 top
LED1  GREEN  [0603-LED]  2,32.3 90 top
LED2  YELLOW  [0603-LED]  28.4,44.9 90 top
LED3  RED  [0603-LED]  26.2,21.1 270 top
LED4  GREEN  [0603-LED]  65.9,49.3 270 top
LED5  GREEN  [0603-LED]  1.6,19.6 90 top
LED6  GREEN  [0603-LED]  27.8,21.1 270 top
PL1  2X20-HEADER  [2X20_0.1"-HEADER]  32.5,52.5 90 top
R1  22R  [0402]  15.1,19.3 90 bottom
R2  22R  [0402]  23.8,11.8 180 bottom
R3  22R  [0402]  17.1,19.3 270 bottom
R4  22R  [0402]  16.1,19.3 90 bottom
R5  22R  [0402]  23.8,10.9 180 bottom
R6  5k1  [0402]  8.9,14.1 90 bottom
R7  49R9  [0402]  71.7,5.8 0 bottom
R8  5k1  [0402]  10.9,15.1 0 bottom
R9  4k7  [0402]  18.9,6 90 bottom
R10  49R9  [0402]  71.7,7.1 0 bottom
R11  49R9  [0402]  71.7,8.4 0 bottom
R12  49R9  [0402]  71.7,12.2 0 bottom
R13  5k1  [0402]  23.8,16.8 180 bottom
R14  DNP  [0402]  10.9,11.6 180 bottom
R15  5k1  [0402]  23.8,13.2 0 bottom
R16  5k1  [0402]  83,16.5 270 bottom
R17  5k1  [0402]  23.8,17.7 0 bottom
R18  5k1  [0402]  20.1,18.8 0 bottom
R19  5k1  [0402]  83.1,4 90 bottom
R20  470R  [0402]  83,14.7 90 bottom
R21  470R  [0402]  83.1,5.8 270 bottom
R22  22R  [0402]  17.9,31.4 0 bottom
R23  22R  [0402]  17.9,28.7 0 bottom
R24  22R  [0402]  17.9,24.6 0 bottom
R25  22R  [0402]  17.9,30.5 0 bottom
R26  22R  [0402]  17.9,26.8 0 bottom
R27  22R  [0402]  17.9,23.5 0 bottom
R28  10k  [0402]  17.9,29.6 180 bottom
R29  10k  [0402]  17.9,25.5 180 bottom
R30  453k  [0402]  3.3,47.2 270 top
R31  100k  [0402]  4.8,47.7 180 top
R32  130R  [0402]  2.2,29.8 270 top
R33  100k  [0402]  48.1,41.8 0 top
R34  100k  [0402]  45.7,43.3 270 top
R35  100k  [0402]  28.2,14.8 270 bottom
R36  47k  [0402]  29.1,14.8 270 bottom
R37  47k  [0402]  30,14.8 270 bottom
R38  47k  [0402]  30.9,14.8 270 bottom
R39  10k  [0402]  37.5,14.8 270 bottom
R40  27k  [0402]  30.8,4.9 270 bottom
R41  10k  [0402]  27,4.9 90 bottom
R42  100k  [0402]  24.4,35.3 90 top
R43  100k  [0402]  22.9,34.9 0 top
R44  1k69  [0402]  29.9,4.9 270 bottom
R45  1k69  [0402]  29,4.9 270 bottom
R46  309R  [0402]  27.04,44.59 90 top
R47  10k  [0402]  31.1,47.3 270 bottom
R48  4k7  [0402]  2.2,28 270 top
R49  47k  [0402]  11.6,29.2 0 top
R50  4k7  [0402]  43.1,41.97 0 top
R51  100R  [0402]  54.29,32.26 180 bottom
R52  22R  [0402]  46.5,29.2 0 top
R53  22R  [0402]  46.4,36.8 180 bottom
R54  22R  [0402]  46.5,27.7 180 bottom
R55  22R  [0402]  43.7,37.3 180 bottom
R56  22R  [0402]  44.2,30.7 180 bottom
R57  22R  [0402]  43.9,31.9 180 bottom
R58  22R  [0402]  43.9,32.8 180 bottom
R59  22R  [0402]  43.9,33.7 180 bottom
R60  22R  [0402]  43.9,29.8 180 bottom
R61  22R  [0402]  43.9,30 0 top
R62  22R  [0402]  46.5,31.4 180 bottom
R63  22R  [0402]  43.9,28.9 180 bottom
R64  22R  [0402]  43.9,29 0 top
R65  22R  [0402]  46.5,30.6 0 top
R66  22R  [0402]  46.5,28.6 180 bottom
R67  22R  [0402]  46.5,30.2 180 bottom
R68  22R  [0402]  43.7,35.3 180 bottom
R69  22R  [0402]  43.7,36.2 180 bottom
R70  22R  [0402]  43.9,28 180 bottom
R71  4k7  [0402]  51.03,34.54 270 bottom
R72  22R  [0402]  43.9,34.1 180 top
R73  22R  [0402]  43.9,35 180 top
R74  22R  [0402]  46.5,35.5 180 top
R75  22R  [0402]  46.5,33.5 180 top
R76  22R  [0402]  46.5,31.6 180 top
R77  22R  [0402]  43.9,32.3 180 top
R78  22R  [0402]  46.5,32.5 180 top
R79  22R  [0402]  43.9,33.2 180 top
R80  22R  [0402]  46.5,36.5 180 top
R81  22R  [0402]  43.9,36 180 top
R82  22R  [0402]  43.9,37 180 top
R83  22R  [0402]  46.5,37.5 180 top
R84  22R  [0402]  43.9,40 180 top
R85  22R  [0402]  43.9,39 180 top
R86  22R  [0402]  46.5,40.4 180 top
R87  22R  [0402]  46.5,39.5 180 top
R88  22R  [0402]  43.9,38 180 top
R89  22R  [0402]  46.8,38.5 180 top
R90  22R  [0402]  44.2,31 180 top
R91  22R  [0402]  46.5,34.5 180 top
R92  866R  [0402]  49.2,19.9 0 bottom
R93  866R  [0402]  41.4,19.9 180 bottom
R94  866R  [0402]  46.9,19.4 270 bottom
R95  866R  [0402]  43.7,19.4 270 bottom
R96  866R  [0402]  48.7,18.5 270 bottom
R97  866R  [0402]  41.9,18.5 270 bottom
R98  866R  [0402]  47,9 90 bottom
R99  866R  [0402]  43.7,9 90 bottom
R100  237R  [0402]  36.4,25.4 270 bottom
R101  470R  [0402]  37.3,25.4 270 bottom
R102  DNP  [0402]  38.2,25.4 270 bottom
R103  DNP  [0402]  39.1,25.4 270 bottom
R104  953R  [0402]  40,25.4 270 bottom
R105  953R  [0402]  40.9,25.4 270 bottom
R106  309R  [0402]  41.8,23.6 270 bottom
R107  237R  [0402]  40,23.6 270 bottom
R108  49R9  [0402]  36.4,23.5 270 bottom
R109  100R  [0402]  50.5,22 270 bottom
R110  3k92  [0402]  48.8,9 270 bottom
R111  3k92  [0402]  41.9,9 270 bottom
R112  3k92  [0402]  49.2,5.7 90 bottom
R113  3k92  [0402]  41.7,5 90 bottom
R114  130R  [0402]  26.9,24 90 top
R115  10k  [0402]  58.7,25.4 180 bottom
R116  10k  [0402]  18.1,36.6 90 top
R117  100k  [0402]  59.1,21.2 90 bottom
R118  10k  [0402]  1.8,26.3 180 top
R119  DNP  [0603]  2,24.1 90 top
R120  680R  [0402]  63,25 90 bottom
R122  43R  [0402]  7.1,23 270 top
R123  43R  [0402]  8,23 270 top
R124  10k  [0402]  66.7,47 270 bottom
R125  130R  [0402]  67.6,49.6 270 top
R126  953R  [0402]  22.77,9.56 90 top
R127  130R  [0402]  2.9,18.3 270 top
R128  47k  [0402]  11.7,32.7 0 top
R129  27k  [0402]  11.6,30.1 180 top
R130  47k  [0402]  11.7,31.8 180 top
R131  4k7  [0402]  8.2,32.5 0 top
R132  10k  [0402]  8.2,33.4 180 top
R133  5k1  [0402]  10.9,13.2 0 bottom
R134  130R  [0402]  27.8,24 90 top
R135  100k  [0402]  46.7,42.2 90 top
R136  953R  [0402]  38.2,22.6 270 top
R137  309R  [0402]  51.4,22 270 bottom
R138  1k5  [0402]  18.9,4.2 90 bottom
R139  100k  [0402]  11.7,33.6 180 top
SK1  [RJ45-HR911105A]  76,10.25 270 top
SK2  SD-CARD-DETECT-MICRO-ALIEXPRESS  [SD-MICRO-ALIEXPRESS]  0,28 90 bottom
SK3  HDMI  [HDMI]  32,7 0 top
SK4  3.5MM-PJ-328B  [3.5MM-PJ-328B]  53.5,0 90 top
SK5  USB-SOCKET-MICRO-B-PTH  [USB-MICRO-B-PTH]  10.6,0 0 top
SK6  USB-A-DUAL  [USB-A-DUAL]  76.7,47 90 top
SK7  USB-A-DUAL  [USB-A-DUAL]  76.7,29 90 top
SW1  SWITCH-SPSTTACT-6X3  [TACT-6X3]  45.2,5.2 270 top
SW2  SWITCH-SPSTTACT-6X3  [TACT-6X3]  16.1,32.2 270 top
TP1  3V3  [P1-10]  20.55,32.88 0 top
TP2  1V8  [P1-10]  60.5,40.8 270 top
TP3  GND  [P1-10]  60.54,12.58 180 top
TP4  1V2  [P1-10]  27.3,47.6 180 top
TR1  MMBT3906  [SOT23]  47.2,22.6 180 bottom
TR2  DMG2305  [SOT23]  16.9,10.6 180 top
X1  25MHz  [XTAL-SMD-32X25]  21.5,23.74 270 top
X2  12MHz  [XTAL-SMD-32X25]  66.4,30.8 270 top
X3  8MHz  [CRYSTAL-ABM3]  14.1,23.8 180 top

## Tracks (layer width: path | path; a pad name or v marks a point on that pad's centre or on a via)
1V2  (via drill 0.25, 0.25 pad 0.41, 0.51 pad 0.81)
  Top 0.127: IC14.12 7.15,32.15 v6.8,32.5
  Top 0.203: IC3.M7 v36.5,35.4 | IC3.L8 v35.7,34.6 | IC3.K9 v34.9,33.8 | IC3.J10 v34.1,33 | IC3.H11 v33.3,32.2 | IC3.K11 v33.3,33.8 | IC3.L10 v34.1,34.6 | IC3.H9 v34.9,32.2 | IC3.J8 v35.7,33 | IC3.G7 v36.5,32.2 | IC3.M12 v32.5,36.2
  Top 0.406: TP4.1 25.35,47.6 v24.75,47
  PWR2 0.127: v6.8,32.5 8.1,31.2 24.3,31.2
  Bottom 0.076: 34.89,32.19 v34.9,32.2
  Bottom 0.127: C44.1 35.06,25.6
  Bottom 0.203: C46.1 34.84,35.34 v34.9,35.4 | 35.06,25.6 35,25.66 v35,26.3
  Bottom 0.254: C45.1 34.89,32.19
  Bottom 0.305: C43.1 25.99,26.8 v26,28.2
  other vias: 25.75,46 24.75,46 24.75,45 24.75,44 25.75,44 24.05,41 24.05,40 25.25,41 25.25,40 25.25,39 25.25,38 25.25,37 25.75,45 25.75,47 25.75,48 24.75,48
  pour PWR2 (rank 2, no thermals): 23.4,48.8 26.2,48.8 26.3,36.9 37.3,36.9 37.2,26 23.4,26
  pour Top (isolate 0.254, no thermals): 21.5,48.7 26.2,48.7 26.2,35.4 23.2,35.4 23.2,41.7 21.5,41.7
1V8  (via drill 0.25, 0.25 pad 0.41, 0.38)
  Top 0.127: IC9.A7 v58.7,38.6 | IC9.A9 v60.3,38.6 | v9.3,32.5 R131.2
  Top 0.203: IC3.R2 v40.5,38.6 | IC3.M4 v39.7,35.4 | IC3.J2 v40.5,33.8 | IC3.J5 v38.9,33.8 | IC3.G4 v38.9,31.4 | IC3.E2 v40.5,29.8 | IC9.C9 v60.5,36.6 | v60.5,36.6 | IC9.E9 v60.5,35 | v60.5,35 | IC9.F9 v60.5,34.2 | v60.5,34.2 | IC9.B1 v52.9,37.4 | v52.9,37.4 | IC9.K9 | IC9.K9 v60.3,31.4 | IC9.D1 | IC9.D1 v53.9,36.2
  Top 0.406: L5.2 54.45,43.35
  Sig2 0.127: v19.9,28.2 19.9,30.8 19.4,31.3 13.4,31.3 13.1,31 10.8,31 v9.3,32.5
  Bottom 0.127: 37.61,29.04 37.46,29.04 37.1,29.4 36.2,29.4 35.2,30.4 32.3,30.4 31.3,29.4 25.8,29.4 24.6,28.2 v19.9,28.2 | v52.9,37.4
  Bottom 0.203: C68.1 61.4,34.18 | C67.1 61.4,39.36 | C65.1 57.03,36.17 57,36.4 v57,35.4 | C64.1 v42.7,27.1 | 38.08,29.02 v38.1,29 38.06,29.04 37.61,29.04 C62.1 | C63.1 v38.89,33.8 v38.9,33.8
  Bottom 0.254: 61.4,39.36 61.79,39.75 v62.3,39.75 | 61.4,34.18 61.38,34.2 v60.5,34.2 | C66.1 61.52,36.6 v60.5,36.6 | C69.1 51.8,37.2 52.7,37.2 v52.9,37.4
  Bottom 0.305: C60.1 46.31,25.5 v45.2,25.5 45.17,25.47 C61.1
  other vias: 61.1,43.25 61.6,41.35 59.3,39.85 59,41.15 57.9,41.15 62.3,44.35 61.1,44.35 58.5,40.45 62.1,40.65 61.1,42.15 62.3,42.15 54.3,40.25 62.3,43.25 53,42.25 49.7,40.65 49.1,42.65 56.5,40.85
  pour PWR2: 61.2,43.7 47.9,43.7 47.9,39.6 37.8,39.6 37.8,24 45.5,24 45.5,30.4 61.2,30.4
  pour Top (no thermals): 62.8,45.1 53.5,45.1 53.5,43 48.4,43 48.4,39.2 62.8,39.2
3V3  (via drill 0.25, 0.25 pad 0.41, 0.38, 0.51 pad 0.76)
  Top 0.127: v1.4,27.7 2.2,27.7 R48.2 | R50.2 43.58,42 v44.1,42 | R116.2 18.05,37.1 v17.3,37.1 | R136.2 38.66,22.16 38.9,22.4 v38.9,23.1
  Top 0.203: IC3.E5 v38.1,29.8 | IC3.D7 v36.5,29 | IC3.E9 v34.9,29.8 | IC3.E10 v34.1,29.8 | IC3.G10 v34.1,31.4 | IC3.J12 v32.5,33 | IC3.J14 v30.9,33 | IC3.G15 v30.1,31.4 | IC3.E14 v31.7,30.6 | IC3.D13 v31.7,29 | IC3.M15 v30.1,35.4 | IC3.J17 v28.5,33 | IC3.E17 v29.3,30.6 | IC3.B1 v42.1,27.4 | IC3.B5 v38.1,28.2 | IC3.K7 v36.5,33.8 | IC3.M9 v35.7,36.2 | IC3.P9 v35.7,37.8 | IC3.P10 v34.9,37 | IC3.R12 v33.3,38.6 | IC3.P14 v30.9,37.8 | IC3.R17 v28.5,37.8 | IC3.P5 v38.1,37.8 | IC3.R6 v37.3,38.6 | IC3.B10 v34.9,28.2 | IC3.B15 v30.9,28.2 | IC3.B17 v28.5,27.4 | IC3.U4 v38.9,40.2 | IC3.U9 v35.7,40.2 | IC3.U14 v30.9,39.4 | IC3.T15 v30.1,38.6 | X1.1 X1.4 22.46,25.4 v23.8,25.4 23.8,24.54 arc90 C42.2 | R46.2 27.04,46.06 v27,46.1 | IC14.31 IC14.32 | C91.2 8.65,23.45 IC14.32 | IC14.32 v9.2,25.5 | IC14.4 10.4,27.75 v10.4,27.7 11.56,27.7 C92.2 | R49.2 v12.8,29.2 | R118.2 1.4,26.3 v1.4,27.7
  Top 0.254: C48.1 25.96,31.8 v24.8,31.8
  Bottom 0.076: 33.59,29.8 C22.1 | 35.73,29 C21.1 | 31.61,30.71 v31.7,30.6 | 31.84,29.07 v31.7,29 | C39.1 | v35.7,40.2 35.68,40.22 35.72,40.27 | 30.12,38.62 v30.1,38.6 | 32.6,37.1 C58.1
  Bottom 0.127: C23.1 32.96,25.26 v33,25.3 | v33.9,23.5 33.19,23.5 | 30.8,4.36 v30.8,2.7 | R107.2 40,23.14 40.1,23.1 v38.9,23.1 | v32.1,14.4 30.9,14.4 R38.2 R37.2 R36.2 | R36.2 R35.2 | R36.2 v29.1,13.4 | v29.1,13.4 | R39.2 38.06,14.36 v38.1,14.4
  Bottom 0.203: C40.1 30.12,38.62 | C38.1 26.63,39.77 v26.6,40.5 | C37.1 27.83,42.43 v27.8,41.2 | 33.19,23.5 C25.1 | R108.2 36.4,23 v37.6,21.8 | C57.1 38.53,36.57 v38.1,37 | 32.5,37.21 v32.5,37.8 | C59.1 33.9,37 v33.3,37 | C39.1 36.5,39.36 v36.5,38.6 | C51.1 31.8,35.4 v32.5,35.4 | C41.1 32.5,33.79 v32.5,34.6 | C49.1 30.1,33.88 v30.1,34.6 | R47.2 31.04,46.8 v29.5,46.8 | R29.2 v18.9,25.5 | R28.2 v19.1,29.6 | v13.6,28.1 14.8,28.1 arc-90 SK2.4 arc90 15.1,27.8 C14.2 | C82.1 28.69,49.57 PL1.17
  Bottom 0.254: v34.1,29.8 33.59,29.8 | v36.5,29 35.73,29 | C50.1 31.61,30.71 | R40.2 30.8,4.36 | 32.6,37.1 32.5,37.21 | C47.1 26.13,31.1 v24.8,31.1
  Bottom 0.305: C8.2 13.2,18.7 L1.1 | C56.1 31.82,42.4 v31.4,42.4 | C54.1 36.45,42.5 v37.6,42.5
  Bottom 0.406: L1.1 v13.3,19.7
  other vias: 2.95,35.4 1.95,35.4 1.95,36.4 2.95,36.4 2.95,37.4 1.95,37.4 1.95,38.4 2.95,38.4 2.95,39.4 1.95,39.4 1.95,40.4 2.95,40.4 2.95,41.4 1.95,41.4 1.95,42.4 1.95,43.4 1.95,44.4 1.95,45.4 1.05,48.9
  pour PWR1 (isolate 0.2, rank 5, no thermals): 0,56 85,56 85,0 0,0
  pour Top (no thermals): 7.2,34.4 1.1,34.4 1.1,47.1 4.6,47.1 4.6,41.5 7.2,41.5
3V3A  (via drill 0.25, 0.51)
  Top 0.203: IC8.19 60.45,26.05 v60.5,26 | IC8.16 61.95,26.05 v62,26.2 | IC8.12 64.95,26.55 v64.9,26.6 | IC8.7 63.95,23.45 v63.9,23.5 | IC8.1 66.3,20.45 v66.3,20.4
  Bottom 0.203: C96.2 v60.5,26 | C99.2 v62,26.2 | v63.9,23.5 63.34,23.5 C97.2 | C53.2 v64.9,26.6
  Bottom 0.254: C94.2 65.54,21.7 v66.8,21.7 | L7.1 60.85,21.1 60.6,21.2 v60.6,22.2
  pour PWR1 (no thermals): 57.6,29.2 67.6,29.2 67.6,17.5 57.6,17.5
3V3E  (via drill 0.25, 0.25 pad 0.41, 0.51, 0.51 pad 0.76, 0.71 pad 1.02)
  Bottom 0.127: C9.2 v25,15.8 | R13.2 v25,16.8 | v25,16.8 | R8.2 10.46,14.14 v10.5,14.1 | D1.1 v7.6,11.6 | R6.2 v8.9,15.2
  Bottom 0.203: v9.7,13.2 R133.2 | C16.2 10.15,8.15 8.25,10.05 D1.1
  Bottom 0.254: R13.2 | IC1.36 C16.2 | L3.2 v25.9,14.5
  Bottom 0.406: C15.2 v8.1,16 | L1.2 v13.3,17
  pour PWR1: 7.1,18.1 28,18.1 28,3.7 7.1,3.7
3V3U  (via drill 0.25, 0.51)
  Top 0.203: IC8.34 57.65,21.45 v57.7,21.4 | IC8.37 57.35,18.95 v57.3,19 | IC8.38 58.45,20.05 v58.4,20.1 | IC8.44 61.45,17.75 v61.5,17.8 | IC8.48 63.45,17.95 v63.6,17.9 | IC8.25 56.45,26.55 v56.4,26.6
  Bottom 0.127: C106.2 56.8,21.3 57.66,21.3 57.7,21.34 v57.7,21.4
  Bottom 0.203: R117.2 v59.1,22.2 | v59.1,22.2 | R115.2 59.15,25.9 | 59.15,25.9 59.15,26.1 D4.2 | v59.7,25.9 59.15,25.9
  Bottom 0.254: L7.2 60.8,19.2 60,18.9 v60,17.5 | C104.2 57.84,22.9 v58.6,22.9
  pour PWR2 (no thermals): 54.9,29.7 67.8,29.7 67.8,17 54.9,17
5V  (via drill 0.25, 0.25 pad 0.41, 0.38, 0.51, 0.71 pad 1.02)
  Top 0.127: IC4.1 46.05,46.05 45.7,46.4 45.7,47.1 45.2,47.6 | IC8.47 62.9,18.95 | R139.2 v10.5,33.6
  Top 0.203: IC2.1 9.65,45.95 9.9,45.7 9.9,45 v11.7,43.2 | IC6.1 17.15,38.45 16.9,38.7 16.9,39.3 16.1,40.1
  Top 0.254: C30.2 38,17.24 IC5.1 | IC8.47 62.95,17.85 v62.9,17.8
  Top 0.3: IC5.1 v38,18.7
  Bottom 0.203: C86.1 9.44,52.3 PL1.4
  Bottom 0.254: C87.2 v43,1.7 | v62.9,17.8 C103.2 64.59,16.34 C102.2 68.36,16.54 v68.9,16
  Bottom 0.305: v29.9,2.7 R44.2 R45.2 | v29.9,2.7 | 44.85,5.88 44.85,2.19 C87.2 | IC11.8 44.85,5.88 | C85.2 44.85,6.7 44.85,5.88 | 45.8,13.65 41.9,13.65 C84.2 | 45.8,13.65 C83.2 | IC10.4 45.3,12.3 v45.8,12.8 45.8,13.65
  Bottom 0.406: IC12.5 66.65,46.51 R124.2 | R124.2 C100.2 | v65.5,46.5 66.64,46.5 R124.2
  other vias: 16.1,42.5 12.8,42.5 12.8,40.3 13.9,41.4 16.1,41.4 13.9,40.3 15,41.4 15,42.5 13.9,42.5 12.8,41.4 10.8,43.2 40.1,48.7 41.3,48.7 42.5,48.7 43.6,48.7 44.8,48.7 42.5,47.6 41.3,47.6 40.1,47.6 40.1,46.2 1.4,17.4 1.4,16.2 1.4,15 1.4,13.8 2.6,16.6 3.9,17.4 5.1,17.4 6.3,17.4 6.3,16.2 6.3,15 6.3,13.9
  pour Top (isolate 0.254, no thermals): 10.2,44.8 16.6,44.8 16.6,39.6 12,39.6 12,42.5 10.2,42.5
  pour Top (no thermals): 45.4,49.2 45.4,47.4 43.5,47.4 43.5,45.6 39.5,45.6 39.5,49.2
  pour PWR2 (isolate 0.254, rank 6, no thermals): 85,56 0,56 0,0 85,0
  pour Top (no thermals): 0.8,12 0.8,18 14.7,18 14.7,13.6 7.8,13.6 7.8,12
25MHZ  (via drill 0.25)
  Top 0.127: X1.3 22.84,22.2 v23.7,22.2 | v34.9,27.4 IC3.A10
  Sig1 0.127: v23.7,22.2 31.3,22.2 33.7,24.6 33.7,26.2 v34.9,27.4
!ATMEL-RST  (via drill 0.25)
  Top 0.127: IC3.J16 v29.3,33.8 | IC14.24 4.35,26.3 v3,26.3 | v3,26.3 | v3,26.3 R118.1 2.24,24.86 R119.2
  Sig1 0.076: v3,26.3 14.4,26.3 15.3,27.2 19.4,27.2 24.6,32.4 27,32.4 28.4,33.8 v29.3,33.8
!CFG-SEL  (via drill 0.25)  (1 unrouted)
  Top 0.076: IC14.21 3.65,27.75 v3.6,27.8
  Top 0.127: IC3.V3 v40.5,41 | v29.3,47.8 IC7.1
  Sig1 0.076: v3.6,27.8 3.2,27.8 3,27.6 2.4,27.6 2.2,27.8 2.2,33.5 2.7,34 8.5,34 13.8,39.3 15.9,39.3 18.4,41.8 18.4,46.2 21.2,49 28.1,49 v29.3,47.8
  Bottom 0.076: v40.5,41 40.5,42.1 39,43.6 39,46.7 37,48.7 30.2,48.7 v29.3,47.8 31.04,47.8
!DDR_CAS  (via drill 0.25 pad 0.41)
  Top 0.127: IC3.K5 v38.9,34.6
  Bottom 0.076: R68.1 41.2,35.3 40.1,34.2 39.3,34.2 v38.9,34.6
!DDR_CASB  (via drill 0.25 pad 0.41)
  Top 0.076: IC9.G8
  Top 0.127: IC9.G8 v58.7,33
  Bottom 0.076: v58.7,33 56.6,33 55.9,33.7 53.2,33.7 51,35.9 50,35.9 49.9,35.8 49.9,35.3 49.8,35.2 49.7,35.2 | 49.7,35.2 | 49.7,35.2 49.6,35.3 49.6,35.8 49.5,35.9 49.4,35.9 49.3,35.8 49.3,35.3 49.2,35.2 49.1,35.2 49,35.3 49,35.8 48.9,35.9 48.7,35.9 48.6,35.8 48.6,35.3 48.3,35 46.2,35 45.8,35.4 44.3,35.4 R68.2
!DDR_RAS  (via drill 0.25 pad 0.41)
  Top 0.127: v39.7,34.6 IC3.L3
  Bottom 0.076: R69.1 40.5,36.2 40.1,35.8 IC3.L3 v39.7,34.6
!DDR_RASB  (via drill 0.25 pad 0.41)
  Top 0.076: IC9.G9
  Top 0.127: IC9.G9 59.7,33.6 59.5,33.8 v58.7,33.8
  Bottom 0.076: v58.7,33.8 58.1,33.2 56.7,33.2 56,33.9 53.3,33.9 50.9,36.3 50.6,36.3 49.7,36.3 49.6,36.4 49.6,36.9 49.5,37 49.4,37 49.3,36.9 49.3,36.4 49.2,36.3 49.1,36.3 49,36.4 49,36.9 48.9,37 48.8,37 47.8,36 45.7,36 45.3,36.4 44.34,36.4 R69.2
!DDR_WE  (via drill 0.25 pad 0.41)
  Top 0.127: IC3.E3 v39.7,29.8
  Bottom 0.076: v39.7,29.8 41.1,28.4 | 41.1,28.4 | 41.1,28.4 42.7,28.4 42.9,28.2 | 42.9,28.2 | 42.9,28.2 43.1,28 43.3,28 R70.1
!DDR_WEB  (via drill 0.25 pad 0.41)
  Top 0.076: IC9.G7 57.8,33.4 57.2,32.8 v57.2,29.3
  Bottom 0.076: R70.2 44.34,28.2 47.4,28.2 47.8,27.8 53.3,27.8 53.4,27.9 53.4,28.5 53.5,28.6 53.6,28.6 53.7,28.5 53.7,28.1 53.8,28 | 53.8,28 | 53.8,28 53.9,28 54,28.1 54.2,28.1 54.3,28 54.4,28 54.5,28.1 54.7,28.1 54.8,28 55.9,28 v57.2,29.3
!ETH-RST  (via drill 0.25)
  Top 0.127: v28.5,29.8 IC3.E18
  Sig2 0.076: v7.8,13.1 8.7,12.2 20.5,12.2 23.5,15.2 25.8,15.2 26.8,16.2 26.8,28.1 v28.5,29.8
  Bottom 0.127: D1.2 7.8,13.05 v7.8,13.1
!FPGA-RESET  (via drill 0.25)
  Top 0.127: IC14.19 3.25,28.75 v3.2,28.7 2.46,28.7 R48.1 | IC3.V2 v40.5,40.2
  Sig1 0.076: v3.2,28.7 4.2,29.7 13.4,29.7 14.7,31 20.2,31 22,32.8 22,35.1 22.8,35.9 30.6,35.9 32.1,37.4 32.1,38 32.3,38.2 39.3,38.2 40.1,39 40.1,39.8 v40.5,40.2
!GL850-RESET  (via drill 0.25)
  Top 0.127: IC3.C5 v38.9,28.2
  Sig2 0.127: v38.9,28.2 39.3,27.8 39.3,27 39.7,26.6 41.4,26.6 42.4,25.6 44,25.6 44.7,26.3 48.6,26.3 49.1,26.8 v55.4,26.8
  Bottom 0.127: D4.1 57.2,27.5 56.8,27.1 55.7,27.1 v55.4,26.8
!SD-DET  (via drill 0.25)
  Top 0.127: IC3.J18 v27.7,33.8
  Sig2 0.076: v21.1,27.4 21.1,31.2 22.3,32.4 22.3,34.3 23.1,35.1 26.4,35.1 v27.7,33.8
  Bottom 0.127: SK2.9 18.6,22.4 21.1,24.9 v21.1,27.4
!SD-SEL  (via drill 0.25)
  Top 0.127: IC14.20 3.15,28.25 v2.9,28 | v19.1,30.5 20.6,29 26.3,29 26.7,28.6 IC3.C18
  Sig1 0.127: v2.9,28 3.2,28.3 13,28.3 15.2,30.5 v19.1,30.5
  Bottom 0.127: v19.1,30.5 R25.1
!VID-EN  (via drill 0.25)
  Top 0.127: IC3.A3 v40.5,27.4
  Bottom 0.127: v40.5,27.4 41.8,26.1 R106.1 C79.1
ATMEL-INT  (via drill 0.25)
  Top 0.076: v3.2,27.3 4.35,27.3 IC14.22
  Top 0.127: IC3.K17 v28.5,34.6
  Sig1 0.076: v3.2,27.3 5,27.3 5.7,26.6 14.1,26.6 15.8,28.3 19.3,28.3 22.6,31.6 22.6,34.1 23.1,34.6 v28.5,34.6
ATMEL-POWER-GOOD  (via drill 0.25)
  Top 0.127: IC3.N18 v27,36.6 | v3.3,30.2 3.3,29.35 3.4,29.25
  Top 0.254: IC14.18 3.4,29.25 2.31,29.25 R32.2
  Sig1 0.076: v27,36.6 26.9,36.5 19.5,36.5 15.9,32.9 10.2,32.9 10,32.7 10,31.5 9,30.5 5.5,30.5 5.1,30.9 4,30.9 v3.3,30.2
ATMEL-RXD
  Top 0.127: IC14.8 9.4,30 10.1,30.7 16.6,30.7 16.9,31 19.9,31 20.9,30 24.5,30 25,30.5 26.9,30.5 27.2,30.8 27.2,31.8 27.6,32.2 28.5,32.2 IC3.H17
ATMEL-TXD
  Top 0.127: IC14.9 9.4,30.5 9.9,31 16,31 16.3,31.3 22.8,31.3 23.9,32.4 26.7,32.4 26.9,32.6 IC3.H18
AUDIO-L  (via drill 0.25)
  Top 0.203: IC3.A5 39.5,26 39.5,20.7 v40.3,19.9
  Bottom 0.203: R93.1 v40.3,19.9
AUDIO-R  (via drill 0.25)
  Top 0.203: IC3.A4 40.8,25.5 40.8,24.3 42.6,22.5 44.6,22.5 45.3,21.8 v45.3,20.8
  Bottom 0.203: R92.1 49.65,20.55 49.4,20.8 v45.3,20.8
DDR_A0  (via drill 0.25 pad 0.41)
  Top 0.076: R52.1 45.76,29.5 v45.3,29.5
  Top 0.127: IC3.J7 37.3,33 v38.1,33
  Sig1 0.076: v45.3,29.5 42.3,32.6 38.5,32.6 v38.1,33
DDR_A0B  (via drill 0.25 pad 0.41)
  Top 0.076: v47.7,29.2 | v47.7,29.2 R52.2
  Top 0.127: v58.7,31.4 IC9.J8
  Sig1 0.076: v58.7,31.4 58.1,30.8 57.5,30.8 57,30.3 57,29.8 55.7,28.5 49.8,28.5 49.1,29.2 v47.7,29.2
DDR_A1  (via drill 0.25 pad 0.41)
  Top 0.127: v38.9,35.4 IC3.L4
  Bottom 0.076: R53.1 40.3,36.8 v38.9,35.4
DDR_A1B  (via drill 0.25 pad 0.41)
  Top 0.127: IC9.J9 v59.5,32.2
  Sig2 0.076: v56.5,34.2 56.5,33 57.3,32.2 v59.5,32.2 | v59.5,32.2
  Bottom 0.076: 53.4,34.2 50.3,37.3 48.5,37.3 48.2,37 47.5,37 46.9,37 R53.2 | 53.4,34.2 | 53.4,34.2 54.2,34.2 54.5,34.5 54.9,34.5 55.2,34.2 v56.5,34.2 | v56.5,34.2
DDR_A2  (via drill 0.25 pad 0.41)
  Top 0.127: IC3.H5 v38.1,32.2
  Bottom 0.076: 38.5,31.8 v38.1,32.2 | 38.5,31.8 | 38.5,31.8 38.5,30.3 38.6,30.2 39.1,30.2 39.3,30 39.3,29.6 39.6,29.3 39.9,29.3 41,28.2 42.5,28.2 43.1,27.6 46.05,27.6 R54.1
DDR_A2B  (via drill 0.25 pad 0.41)
  Top 0.127: IC9.K7 v58.3,30.4
  Bottom 0.076: v58.3,30.4 58.3,29.7 56.1,27.5 46.94,27.5 R54.2 47.15,27.6
DDR_A3  (via drill 0.25 pad 0.41)
  Top 0.127: v39.7,37.8 IC3.P3
  Bottom 0.076: R55.1 40.2,37.3 v39.7,37.8
DDR_A3B  (via drill 0.25 pad 0.41)
  Top 0.127: IC9.K8 v59.5,31.4
  Sig2 0.076: v56.3,35.1 58,33.4 59.8,33.4 59.9,33.3 59.9,31.8 v59.5,31.4 | v59.5,31.4
  Bottom 0.076: R55.2 44.4,37.5 44.5,37.6 49.4,37.6 49.5,37.6 50.4,37.6 52.2,35.8 55.6,35.8 v56.3,35.1
DDR_A4  (via drill 0.25 pad 0.41)
  Top 0.127: IC3.F3 v39.7,30.6
  Bottom 0.076: v39.7,30.6 40,30.6 40.1,30.7 40.1,30.9 40.2,31 42.3,31 | 42.3,31 | 42.3,31 42.7,30.6 43.66,30.6 R56.1
DDR_A4B  (via drill 0.25 pad 0.41)
  Top 0.127: IC9.K2 v54.3,30
  Bottom 0.076: v54.3,30 52.6,30 52.1,30.5 52,30.5 51.9,30.4 51.8,30.4 51.7,30.5 51.7,30.9 51.6,31 51.5,31 51.4,30.9 51.4,30.5 51.3,30.4 51.2,30.4 51.1,30.5 51.1,31.1 51,31.2 50.9,31.2 50.8,31.1 50.8,30.5 50.7,30.4 50.6,30.4 50.5,30.5 50.5,31.1 50.4,31.2 50.3,31.2 50.2,31.1 50.2,30.5 50.1,30.4 50,30.4 49.9,30.5 49.9,31.1 49.8,31.2 49.7,31.2 49.6,31.1 49.6,30.5 49.5,30.4 49.4,30.4 49.3,30.5 49.3,31.1 49.2,31.2 49.1,31.2 49,31.1 49,30.5 48.9,30.4 48.8,30.4 48.7,30.5 48.7,31.1 48.6,31.2 48.5,31.2 48.4,31.1 48.4,30.5 48.3,30.4 48.2,30.4 48.1,30.5 48.1,30.9 48,31 47.9,31 47.8,30.9 47.8,30.5 47.7,30.4 47.6,30.4 47.4,30.6 44.9,30.6 44.7,30.8 44.6,30.8 R56.2
DDR_A5  (via drill 0.25 pad 0.41)
  Top 0.127: IC3.H4 v38.9,32.2
  Bottom 0.076: v38.9,32.2 39.3,31.8 39.9,31.8 40.3,32.2 43.16,32.2 R57.1
DDR_A5B  (via drill 0.25 pad 0.41)
  Top 0.127: IC9.K3 v55.8,31
  Bottom 0.076: R57.2 44.34,31.8 45.6,31.8 46,32.2 48.1,32.2 48.6,31.7 48.7,31.7 48.8,31.8 48.8,32.2 48.9,32.3 49,32.3 49.1,32.2 49.1,31.7 49.2,31.6 49.3,31.6 49.4,31.7 49.4,32.2 49.5,32.3 49.6,32.3 49.7,32.2 49.7,31.7 49.8,31.6 49.9,31.6 50,31.7 50,32.2 50.1,32.3 50.2,32.3 50.3,32.2 50.3,31.7 50.4,31.6 50.5,31.6 50.6,31.7 50.6,32.2 50.7,32.3 50.8,32.3 50.9,32.2 50.9,31.7 51,31.6 51.1,31.6 51.2,31.7 51.2,32.2 51.3,32.3 51.4,32.3 51.8,31.9 51.8,31.6 52.4,31 54.4,31 54.5,31.1 54.5,31.6 54.6,31.7 54.7,31.7 55.4,31 v55.8,31
DDR_A6  (via drill 0.25 pad 0.41)
  Top 0.127: IC3.H3 v39.7,32.2
  Bottom 0.076: v39.7,32.2 39.9,32.4 41.5,32.4 41.6,32.5 41.6,32.7 41.7,32.8 41.8,32.8 41.9,32.7 41.9,32.5 42,32.4 42.1,32.4 42.2,32.5 42.2,33.2 42.3,33.3 42.4,33.3 42.5,33.2 42.5,32.5 42.6,32.4 42.7,32.4 42.8,32.5 42.8,32.7 42.9,32.8 R58.1
DDR_A6B  (via drill 0.25 pad 0.41)
  Top 0.127: IC9.J1 53.1,31.4 v52.8,31.4
  Bottom 0.076: 44.3,32.8 R58.2 44.8,32.8 45.6,32.8 45.7,32.7 45.7,32.6 45.8,32.5 45.9,32.5 46,32.6 46,33.4 46.1,33.5 46.2,33.5 46.3,33.4 46.3,32.6 46.4,32.5 46.5,32.5 46.6,32.6 46.6,33.4 46.7,33.5 46.8,33.5 46.9,33.4 46.9,32.6 47,32.5 47.1,32.5 47.2,32.6 47.2,32.9 47.3,33 47.4,33 47.5,32.9 47.5,32.6 47.6,32.5 47.7,32.5 47.8,32.6 47.8,32.9 47.9,33 48,33 48.1,32.9 48.1,32.6 48.2,32.5 48.3,32.5 48.4,32.6 48.4,33 48.5,33.1 48.6,33.1 48.7,33 48.7,32.7 48.8,32.6 48.9,32.6 49,32.7 49,33 49.1,33.1 49.2,33.1 49.3,33 49.3,32.7 49.4,32.6 49.5,32.6 49.6,32.7 49.6,33 49.7,33.1 49.8,33.1 49.9,33 49.9,32.7 50,32.6 50.1,32.6 50.2,32.7 50.2,32.9 50.3,33 50.4,33 50.5,32.9 50.5,32.7 50.6,32.6 50.7,32.6 50.9,32.8 | v52.8,31.4 51.4,32.8 50.9,32.8 | 50.9,32.8
DDR_A7  (via drill 0.25 pad 0.41)
  Top 0.127: IC3.H6 v37.3,32.2
  Bottom 0.076: v37.3,32.2 37.7,31.8 37.7,31.1 37.6,31 37,31 36.9,31.1 36.9,32.5 37,32.6 39.4,32.6 39.5,32.7 39.5,33 39.6,33.1 39.7,33.1 39.8,33 39.8,32.8 40,32.6 40.1,32.6 40.2,32.7 40.2,33 40.3,33.1 40.4,33.1 40.5,33 40.5,32.7 40.6,32.6 | 40.6,32.6 | 40.6,32.6 40.9,32.6 41,32.7 41,33 41.1,33.1 41.1,33.3 41.4,33.6 41.5,33.6 41.6,33.5 41.6,33.2 41.7,33.1 41.8,33.1 41.9,33.2 41.9,33.5 42.1,33.7 R59.1
DDR_A7B  (via drill 0.25 pad 0.41)
  Top 0.076: v53.9,31.4
  Top 0.127: IC9.J2 v53.9,31.4
  Bottom 0.076: R59.2 46.5,33.7 46.9,34.1 49.7,34.1 50.5,33.3 52,33.3 v53.9,31.4
DDR_A8  (via drill 0.25 pad 0.41)
  Top 0.076: IC3.D2 41.3,29.8 v42.2,29.8
  Bottom 0.076: R60.1 v42.2,29.8
DDR_A8B  (via drill 0.25 pad 0.41)
  Top 0.076: IC9.J3 56.1,31.8 56.2,31.7 56.3,31.6 v56.3,29.9
  Bottom 0.076: R60.2 44.4,29.9 45.6,29.9 46.2,29.3 46.3,29.3 46.4,29.4 46.4,29.6 46.5,29.7 46.6,29.7 46.7,29.6 46.7,29.4 46.8,29.3 46.9,29.3 47,29.4 47,29.6 47.1,29.7 47.4,29.7 47.6,29.9 48.1,29.9 48.2,29.8 48.2,29.4 48.3,29.3 48.4,29.3 48.5,29.4 48.5,29.8 48.6,29.9 48.7,29.9 48.8,29.8 48.8,29.4 48.9,29.3 49,29.3 49.1,29.4 49.1,29.8 49.2,29.9 49.3,29.9 49.4,29.8 49.4,29.5 49.5,29.4 49.6,29.4 49.7,29.5 49.7,29.8 49.8,29.9 49.9,29.9 50,29.8 50,29.6 50.1,29.5 50.2,29.5 50.3,29.6 50.3,29.8 50.4,29.9 50.5,29.9 50.6,29.8 50.6,29.6 50.7,29.5 50.8,29.5 50.9,29.6 50.9,29.8 51,29.9 51.8,29.9 52.3,29.4 55,29.4 55.1,29.3 55.1,28.9 55.2,28.8 55.5,28.8 55.6,28.9 55.6,29 55.5,29.1 55.4,29.1 55.3,29.2 55.3,29.4 55.1,29.6 55.1,29.8 55.3,30 55.4,30 55.5,29.9 55.8,29.9 55.9,29.9 v56.3,29.9
DDR_A9  (via drill 0.25 pad 0.41)
  Top 0.076: IC3.G6 v37.3,31.4 | v42.1,30.6 42.85,30.6 R61.1
  Sig2 0.076: v37.3,31.4 37.7,31 41.7,31 v42.1,30.6
DDR_A9B
  Top 0.076: IC9.H1 53.2,32.3 50.9,32.3 50.8,32.2 50.8,32.1 50.9,32 51.9,32 52,31.9 52,31.8 51.9,31.7 50.9,31.7 50.8,31.6 50.8,31.5 50.9,31.4 51.9,31.4 52,31.3 52,31.2 51.9,31.1 50.9,31.1 50.8,31 50.8,30.9 50.9,30.8 51.9,30.8 52,30.7 52,30.6 51.9,30.5 50.9,30.5 50.8,30.4 50.8,30.2 | 50.8,30.2 | 50.8,30.2 50.8,30.1 50.7,30 50.6,30 R61.2
DDR_A10  (via drill 0.25 pad 0.41)
  Top 0.127: IC3.F4 v38.9,30.6
  Bottom 0.076: v38.9,30.6 IC3.F4 39.9,31 40.1,31.2 40.1,31.7 40.3,31.9 41.5,31.9 42,31.4 42.9,31.4 45,31.4 R62.1
DDR_A10B  (via drill 0.25 pad 0.41)
  Top 0.076: v57.9,31.4
  Top 0.127: IC9.J7 v57.9,31.4
  Bottom 0.076: R62.2 47.15,31.2 48.1,31.2 48.3,31.4 48.6,31.4 50.84,31.4 51.5,31.4 52.7,30.2 53.3,30.2 53.6,30.5 56,30.5 56.2,30.7 56.2,32.2 56.3,32.3 56.4,32.3 56.5,32.2 56.5,31.5 56.6,31.4 56.7,31.4 56.8,31.5 56.8,32.2 56.9,32.3 57,32.3 57.1,32.2 57.1,31.5 57.2,31.4 v57.9,31.4
DDR_A11  (via drill 0.25 pad 0.41)
  Top 0.076: IC3.D3 40.5,29.4 40.6,29.3 40.6,29.1 40.7,29 v42.2,29
  Bottom 0.076: v42.2,29 43.3,29 R63.1
DDR_A11B  (via drill 0.25 pad 0.41)
  Top 0.076: IC9.H2 54.7,32.2 54.7,29.8 v54.7,29
  Bottom 0.076: 49,28.3 49.9,28.3 50,28.4 50,29.1 50.1,29.2 50.2,29.2 50.3,29.1 50.3,28.4 50.4,28.3 50.5,28.3 50.6,28.4 50.6,29.1 50.7,29.2 50.8,29.2 50.9,29.1 50.9,28.4 51,28.3 51.1,28.3 51.2,28.4 51.2,28.7 51.3,28.8 51.4,28.8 51.5,28.7 51.5,28.4 51.6,28.3 51.7,28.3 51.8,28.4 51.8,29.1 51.9,29.2 52,29.2 52.1,29.1 52.1,28.4 52.2,28.3 52.3,28.3 52.4,28.4 52.4,28.9 52.5,29 v54.7,29 | 49,28.3 | 49,28.3 48.9,28.4 48.9,28.7 48.8,28.8 48.7,28.8 48.6,28.7 48.6,28.4 48.5,28.3 48.4,28.3 48.3,28.4 48.3,28.6 48.2,28.7 47.6,28.7 47.2,29.1 44.6,29.1 R63.2
DDR_A12
  Top 0.076: IC3.D1 43.06,29.4 R64.1
DDR_A12B
  Top 0.076: IC9.H3 56.2,32.6 56.8,32 56.8,29.5 55.8,28.5 49.9,28.5 49.8,28.6 49.8,29.5 49.7,29.6 49.6,29.6 49.5,29.5 49.5,28.6 49.4,28.5 49.3,28.5 49.2,28.6 49.2,29.5 49.1,29.6 49,29.6 48.9,29.5 48.9,28.6 48.8,28.5 48.7,28.5 48.6,28.6 48.6,29.5 48.5,29.6 48.4,29.6 48.3,29.5 48.3,28.7 48.1,28.5 44.84,28.5 R64.2
DDR_A13  (via drill 0.25 pad 0.41)
  Top 0.076: R65.1 43.4,30.6 v43,31 | v38.1,30.6 IC3.F6
  Sig1 0.076: v43,31 38.5,31 v38.1,30.6
DDR_A13B
  Top 0.076: IC9.F7 | R65.2 49.3,30.6 49.4,30.7 49.4,31.7 49.5,31.8 49.7,31.8 49.8,31.7 49.8,31.3 49.9,31.2 50.1,31.2 50.2,31.3 50.2,33.5 50.5,33.8 55.7,33.8 56.6,32.9 57,32.9 IC9.F7
DDR_BA0  (via drill 0.25 pad 0.41)
  Top 0.127: IC3.F2 v40.5,30.6
  Bottom 0.076: v40.5,30.6 | v40.5,30.6 41.6,29.5 41.6,28.7 41.7,28.6 42.9,28.6 43.1,28.4 45.9,28.4 46,28.5 R66.1
DDR_BA0B  (via drill 0.25 pad 0.41)
  Top 0.076: v57.7,30 57.4,30.3 57.4,31.6 58,32.2 58.7,32.2 IC9.H8 | IC9.H8
  Bottom 0.076: R66.2 46.9,28.6 47.1,28.8 46.9,28.5 47,28.4 47.6,28.4 48,28 52.6,28 52.7,28.1 52.7,28.6 52.9,28.8 54.2,28.8 54.5,28.5 55.1,28.5 55.3,28.5 55.8,28.5 55.9,28.6 55.9,29.2 56,29.3 56.5,29.3 | 56.5,29.3 57.2,30 v57.7,30 | 56.5,29.3
DDR_BA1  (via drill 0.25 pad 0.41)
  Top 0.127: IC3.F1 v41.3,30.6
  Bottom 0.076: R67.1 41.7,30.2 v41.3,30.6
DDR_BA1B  (via drill 0.25 pad 0.41)
  Top 0.076: IC9.H9
  Top 0.127: IC9.H9 v59.5,33
  Bottom 0.076: v59.5,33 60.5,33 60.6,32.9 60.6,32.3 60.5,32.2 60.5,32 60.6,31.9 61.3,31.9 61.4,31.8 61.4,31.2 61.2,31 56.8,31 56.1,30.3 55.2,30.3 54.5,29.6 52.7,29.6 52.1,30.2 R67.2 | v59.5,33
DDR_CK_N  (via drill 0.25 pad 0.41)  (1 unrouted)
  Top 0.076: IC9.G3
  Top 0.127: IC3.G1 v42.4,31.8 | IC9.G3 | IC9.G3 v54.7,33
  Sig2 0.127: v42.4,31.8 42.7,31.5 43.2,31.5 43.45,31.75 43.65,31.75 44.71,31.75 44.96,31.5 45.54,31.5 46.34,32.3 46.86,32.3 47,32.16 47,30.26 47.36,29.9 47.74,29.9 48.19,30.35 48.66,30.35 49,30.01 49,29.6 arc90 49.3,29.3 49.4,29.3 arc90 49.7,29.6 49.7,30.6 arc-90 49.8,30.7 49.9,30.7 arc-90 50,30.6 50,29.6 arc90 50.3,29.3 50.4,29.3 arc90 50.7,29.6 50.7,31.1 arc-90 50.8,31.2 51.1,31.2 arc90 51.5,31.6 51.5,31.7 arc-90 51.8,32 53,32 53.4,31.6 53.4,31.1 53.6,30.9 54.1,30.9 54.7,31.5 v54.7,33
  Bottom 0.076: v54.7,33 54.7,32.26 R51.2
DDR_CK_P  (via drill 0.25 pad 0.41)
  Top 0.127: IC3.G3 v39.7,31.4 | IC9.G2 v53.9,33 | v53.9,33
  Sig2 0.127: v39.7,31.4 40.6,32.3 42.8,32.3 43.1,32 44.74,32 45.04,31.7 45.46,31.7 46.26,32.5 46.94,32.5 47.2,32.24 47.2,30.34 47.44,30.1 47.66,30.1 48.11,30.55 48.74,30.55 49.2,30.09 49.2,29.6 arc90 49.3,29.5 49.4,29.5 arc90 49.5,29.6 49.5,30.6 arc-90 49.8,30.9 49.9,30.9 arc-90 50.2,30.6 50.2,29.6 arc90 50.3,29.5 50.4,29.5 arc90 50.5,29.6 50.5,31.1 arc-90 50.8,31.4 51.1,31.4 arc90 51.3,31.6 51.3,31.7 arc-90 51.8,32.2 53.1,32.2 v53.9,33
  Bottom 0.076: R51.1 arc90 53.9,32.31 v53.9,33
DDR_CKE  (via drill 0.25 pad 0.41)
  Top 0.076: IC9.G1
  Top 0.127: IC9.G1 v53,32.9 | IC3.H7 v36.5,33
  Bottom 0.076: v36.5,33 36.9,33.4 40.7,33.4 41.6,34.3 41.6,34.6 41.7,34.7 41.8,34.7 41.9,34.6 41.9,34.3 42,34.2 42.1,34.2 42.2,34.3 42.2,34.6 42.3,34.7 42.4,34.7 42.5,34.6 42.5,34.3 42.6,34.2 42.7,34.2 42.8,34.3 42.8,34.6 42.9,34.7 43,34.7 43.1,34.6 43.1,34.3 43.2,34.2 43.3,34.2 43.4,34.3 43.4,34.6 43.5,34.7 43.6,34.7 43.7,34.6 43.7,34.3 43.8,34.2 43.9,34.2 44,34.3 44,34.6 44.1,34.7 44.2,34.7 44.3,34.6 44.3,34.3 44.4,34.2 44.5,34.2 44.6,34.3 44.6,34.5 44.7,34.6 45.6,34.6 45.7,34.5 45.7,34.3 45.8,34.2 45.9,34.2 46,34.3 46,34.6 46.1,34.7 46.2,34.7 46.3,34.6 46.3,34.3 46.4,34.2 46.5,34.2 46.6,34.3 46.6,34.5 46.7,34.6 47.3,34.6 47.4,34.6 48.3,34.6 48.6,34.9 49.5,34.9 50.3,34.09 R71.2 51.8,34.09 v53,32.9
DDR_DQ0
  Top 0.076: IC3.L2 41.3,35.4 42.7,35.4 42.8,35.5 R74.2
DDR_DQ0B  (via drill 0.25 pad 0.41)
  Top 0.076: R74.1 v47.6,35.5
  Top 0.127: IC9.B8 v58.7,37.8
  Sig1 0.076: v58.7,37.8 55.2,41.3 52.3,41.3 51.4,40.4 50.3,40.4 50.2,40.3 50.2,40.2 50.3,40.1 50.5,40.1 50.6,40 50.6,39.9 50.5,39.8 49,39.8 47.6,38.4 47.6,37.4 47,36.8 47,36.1 v47.6,35.5
DDR_DQ1
  Top 0.076: IC3.L1 R73.2
DDR_DQ1B  (via drill 0.25 pad 0.41)
  Top 0.076: R73.1 v45.2,35
  Top 0.127: v57.9,37.8 IC9.B7
  Sig1 0.076: v45.2,35 47.8,35 48.2,35.4 48.2,37.9 48.3,38 49.4,38 49.5,38.1 49.5,38.2 49.4,38.3 49,38.3 48.9,38.4 48.9,38.5 49,38.6 50,38.6 50.1,38.7 50.1,38.8 50,38.9 49,38.9 48.9,39 48.9,39.1 49,39.2 50.7,39.2 52.2,40.7 55,40.7 v57.9,37.8
DDR_DQ2
  Top 0.076: IC3.K2 41.3,33.8 42.9,33.8 43,33.7 45.9,33.7 | 45.9,33.7 | 45.9,33.7 R75.2
DDR_DQ2B  (via drill 0.25 pad 0.41)
  Top 0.076: v47.6,33.5 R75.1
  Top 0.127: IC9.C7 v57.9,37
  Sig1 0.076: v57.9,37 | v57.9,37 57.3,37.6 57.3,37.8 55.3,39.8 54.7,39.8 52,39.8 50.1,37.9 50.1,37.6 50,37.5 49.1,37.5 49,37.4 49,37.3 49.1,37.2 49.5,37.2 49.6,37.1 49.6,37 49.5,36.9 48.8,36.9 48.7,36.8 48.7,36.7 48.8,36.6 49.5,36.6 49.6,36.5 49.6,36.4 49.5,36.3 48.8,36.3 48.7,36.2 48.7,35.2 47.6,34.1 v47.6,33.5
DDR_DQ3
  Top 0.076: IC3.K1 43.2,34.2 43.3,34.1
  Top 0.127: 43.3,34.1 R72.2
DDR_DQ3B  (via drill 0.25 pad 0.41)
  Top 0.076: R72.1 v45.2,34.1
  Top 0.127: IC9.A8 v59.5,38.6
  Sig1 0.076: v45.2,34.1 44.7,34.6 44.7,35.3 44.9,35.5 45.6,35.5 46.5,36.4 46.5,39.4 47.2,40.1 48.4,40.1 50.1,41.8 56.3,41.8 v59.5,38.6
DDR_DQ4
  Top 0.076: IC3.H2 41,32.6 41.4,32.2 42.7,32.2 43.3,31.6 R76.2
DDR_DQ4B  (via drill 0.25 pad 0.41)
  Top 0.076: R76.1 v47.8,31.6
  Top 0.127: v59.5,36.2 IC9.C8
  Sig1 0.076: v47.8,31.6 | v59.5,36.2 60,35.7 60,34.2 59.1,33.3 59.1,32.6 58.4,31.9 57.6,31.9 55.2,31.9 53.4,30.1 47.9,30.1 47.8,30.2 v47.8,31.6
DDR_DQ5
  Top 0.076: IC3.H1 42.8,32.6 43.1,32.3 R77.2
DDR_DQ5B  (via drill 0.25 pad 0.41)
  Top 0.076: R77.1 v45.2,32.3
  Top 0.127: v57.8,35.3 IC9.D7